# EAGLE design BlueBus (EAGLE 9.6.2)

## Sheet 1 of 5
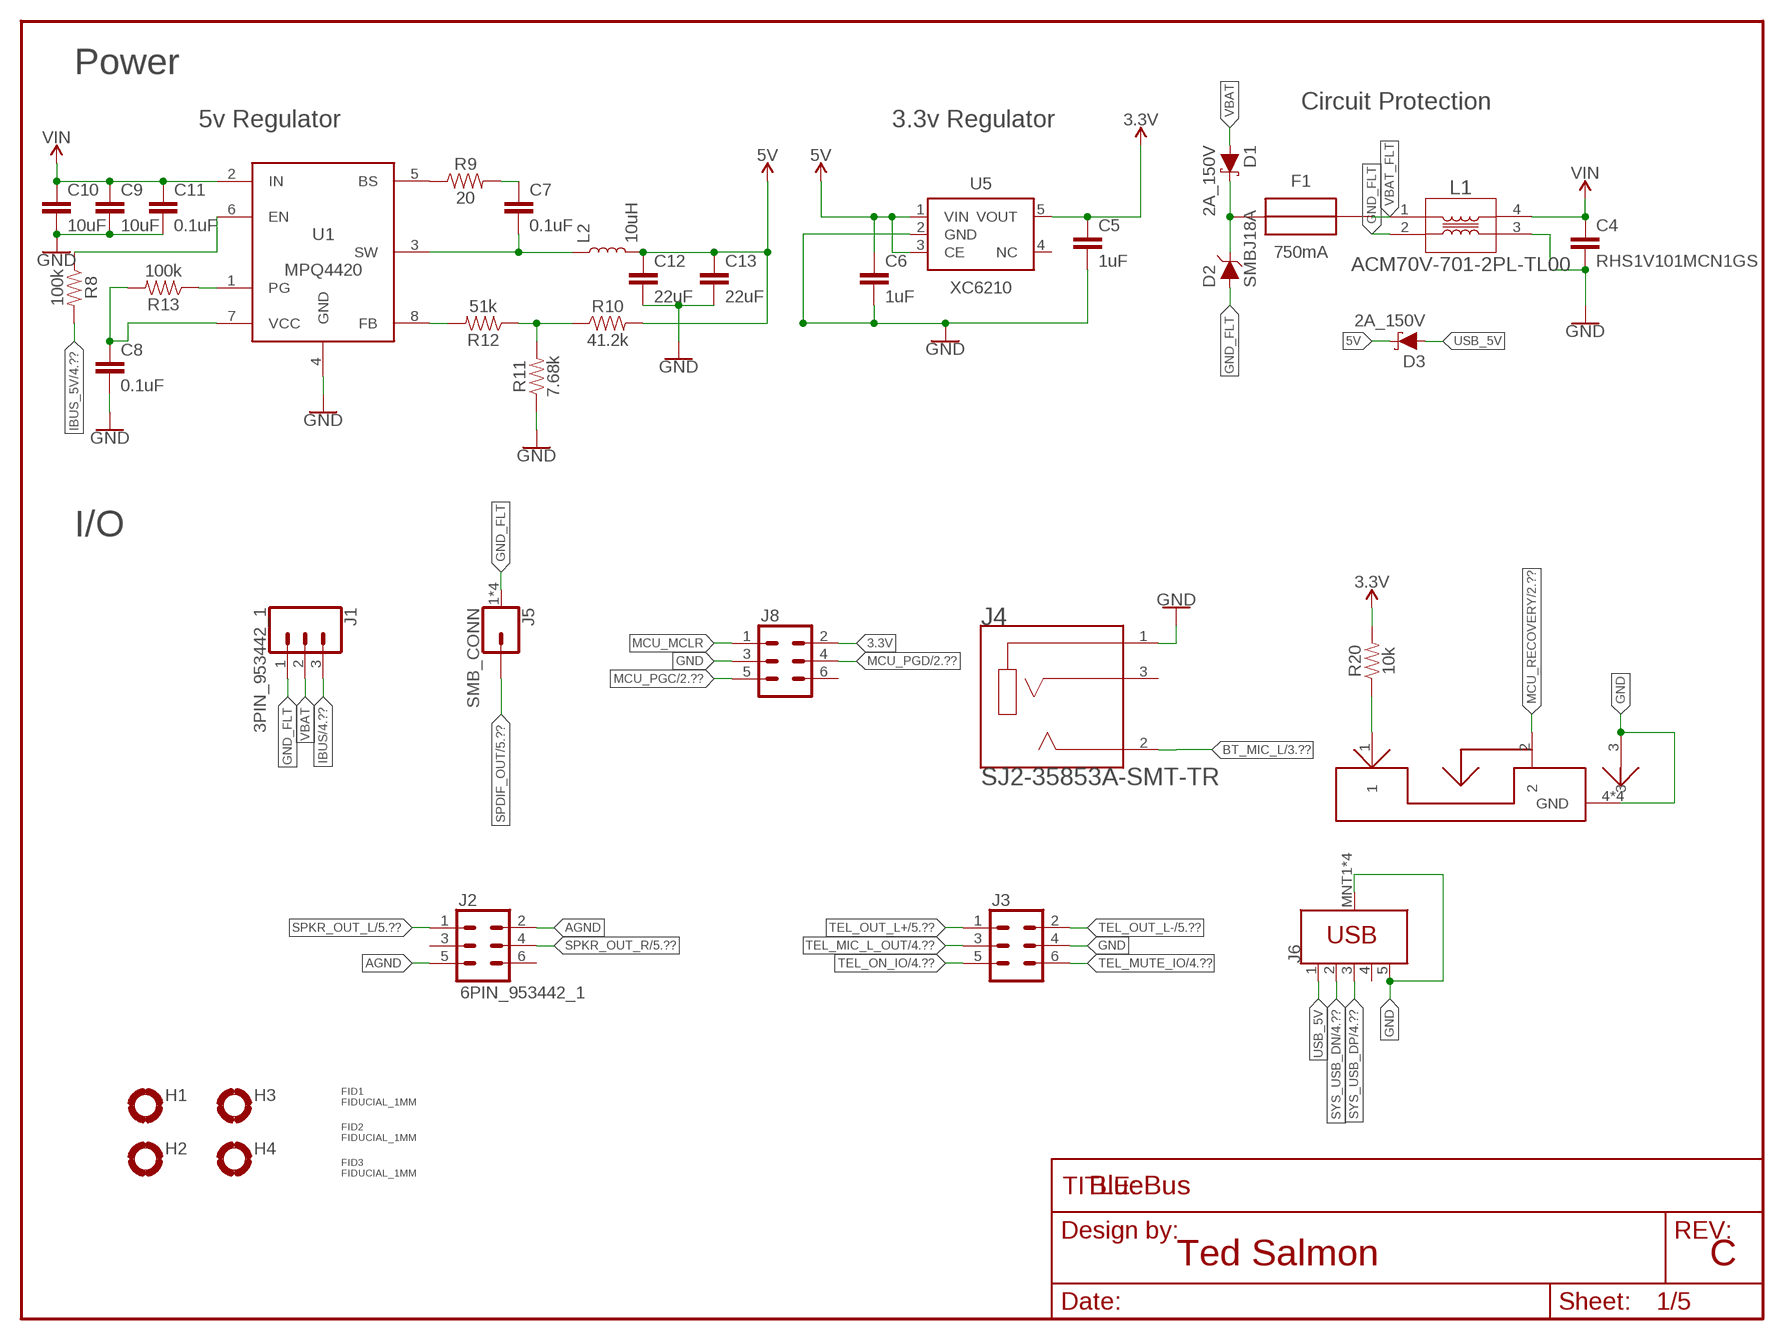
[diagram p0: schematic, sheet 1]

### Parts
C4  RHS1V101MCN1GS  [RHS1V101MCN1GS]
C5  1uF  1UF0603  [0603]
C6  1uF  1UF0603  [0603]
C7  0.1uF  0.1UF0603  [0603]
C8  0.1uF  0.1UF0603  [0603]
C9  10uF  10UF  [1206]
C10  10uF  10UF  [1206]
C11  0.1uF  0.1UF0603  [0603]
C12  22uF  22UF  [0805]
C13  22uF  22UF  [0805]
D1  2A_150V  SMD2150PL_2A_150V  [SOD123FL-2]
D2  SMBJ18A  [DO-214AA]
D3  2A_150V  SMD2150PL_2A_150V  [SOD123FL-2]
F1  750mA  LITTLEBLOCK_FUSE_.75A  [LITTLEFUSE]
FID1  FIDUCIAL_1MM  [FIDUCIAL_1MM]
FID2  FIDUCIAL_1MM  [FIDUCIAL_1MM]
FID3  FIDUCIAL_1MM  [FIDUCIAL_1MM]
FRAME1  FRAME-LETTER  [DUMMY]
H1  2,5-HOLE  [2.5-HOLE]
H2  2,5-HOLE  [2.5-HOLE]
H3  2,5-HOLE  [2.5-HOLE]
H4  2,5-HOLE  [2.5-HOLE]
J1  3PIN_953442_1  [TE_MQS_3PIN]
J2  6PIN_953442_1  [TE_MQS_6PIN]
J3  6PIN_5_103166_1  [TE_AMPMODU_6_PIN]
J4  SJ2-35853A-SMT-TR  [CUI_SJ2_35853A_SMT_TR]
J5  SMB_CONN  [MOLEX_SMB]
J6  USB3080-30-01-A  [USB3080-30-01-A]
J7  PCM12SMTR  [PCM12SMTR]
J8  TC2030NL  [TC2030-NL]
L1  ACM70V-701-2PL-TL00  [ACM70V-701-2PL-TL00]
L2  10uH  MPL-SE5040-100  [MPL-SE5040]
R8  100k  100KOHM0603  [0603]
R9  20  20OHM0603  [0603]
R10  41.2k  41.2KOHM0603  [0603]
R11  7.68k  7.68KOHM0603  [0603]
R12  51k  51KOHM0603  [0603]
R13  100k  100KOHM0603  [0603]
R20  10k  10KOHM0603  [0603]
U1  MPQ4420  [TSOT23-8]
U5  XC6210  XC6210SOT25  [SOT23-5]

### Nets
3.3V [3.3V]: C5.1 J8.2 R20.2 U5.5(VOUT) ; also sheet 2,3,4,5
5V [USB_5V]: C6.1 C12.1 C13.1 D3.C L2.2 R10.2 U5.1(VIN) U5.3(CE) ; also sheet 4,5
5VREG_BS: R9.1 U1.5(BS)
5VREG_BS_CAP: C7.1 R9.2
5VREG_EN: R8.1 U1.6(EN)
5VREG_FB: R12.2 U1.8(FB)
5VREG_FB_T: R10.1 R11.2 R12.1
5VREG_PG: R13.1 U1.1(PG)
5VREG_SW: C7.2 L2.1 U1.3(SW)
5VREG_VCC: C8.1 R13.2 U1.7(VCC)
AGND: J2.2 J2.5 ; also sheet 5
BT_MIC_L: J4.2(TIP) ; also sheet 3,4
GND: C4.2 C5.2 C6.2 C8.2 C9.2 C10.2 C11.2 C12.2 C13.2 J3.4 J4.1(SLEEVE) J6.5(GND) J6.MNT1(SHIELD) J6.MNT2(SHIELD) J6.MNT3(SHIELD) J6.MNT4(SHIELD) J7.3 J7.4(GND) J7.5(GND) J7.6(GND) J7.7(GND) J8.3 L1.3 R11.1 U1.4(GND) U5.2(GND) ; also sheet 2,3,4,5
GND_FLT: D2.A J1.1 J5.1(GND) J5.2(GND) J5.3(GND) J5.4(GND) L1.2
IBUS [Data]: J1.3 ; also sheet 4
IBUS_5V: R8.2 ; also sheet 4
MCU_MCLR [MCU_Data]: J8.1 ; also sheet 2
MCU_PGC [MCU_Data]: J8.5 ; also sheet 2
MCU_PGD [MCU_Data]: J8.4 ; also sheet 2
MCU_RECOVERY [MCU_Data]: J7.2 ; also sheet 2
RECOVERY_ON [MCU_Data]: J7.1 R20.1
SPDIF_OUT: J5.P$1 ; also sheet 5
SPKR_OUT_L: J2.1 ; also sheet 5
SPKR_OUT_R: J2.4 ; also sheet 5
SYS_USB_DN [Data]: J6.2(D-) ; also sheet 4
SYS_USB_DP [Data]: J6.3(D+) ; also sheet 4
TEL_MIC_L_OUT: J3.3 ; also sheet 4
TEL_MUTE_IO: J3.6 ; also sheet 4
TEL_ON_IO: J3.5 ; also sheet 4
TEL_OUT_L+: J3.1 ; also sheet 5
TEL_OUT_L-: J3.2 ; also sheet 5
USB_5V: D3.A J6.1(VBUS)
VBAT: D1.A J1.2
VBAT_DIODE: D1.C D2.C F1.IN(OUT)
VBAT_FLT: F1.OUT(IN) L1.1
VIN [VIN]: C4.1 C9.1 C10.1 C11.1 L1.4 U1.2(IN) ; also sheet 4
Unconnected: J2.3 J2.6 J4.3(RING) J6.4(ID) J8.6 U5.4(NC)

### Notes on the sheet
- Power
- Circuit Protection
- 5v Regulator | 3.3v Regulator
- I/O
- Ted Salmon | C

## Sheet 2 of 5
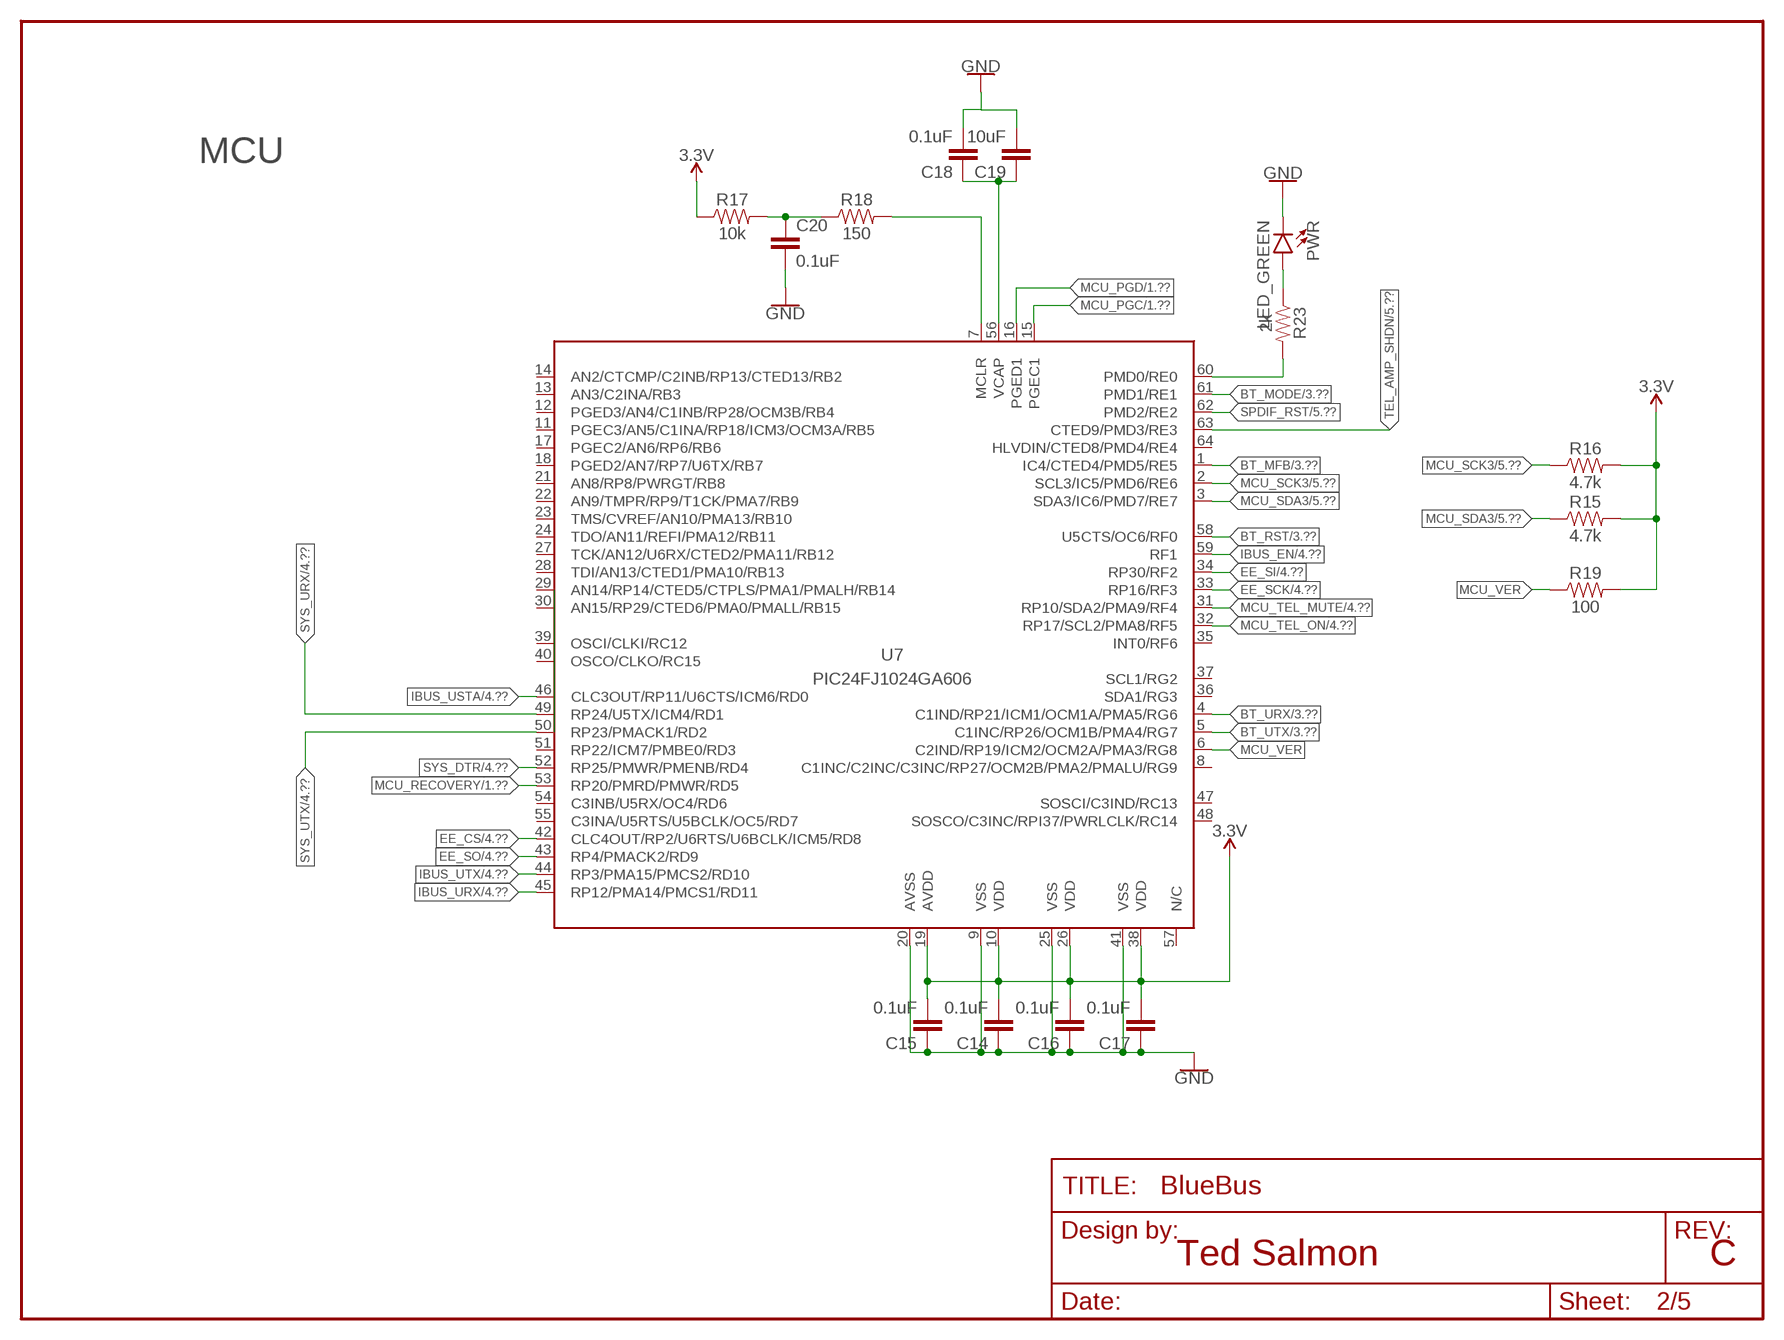
[diagram p1: schematic, sheet 2]

### Parts
C14  0.1uF  0.1UF0603  [0603]
C15  0.1uF  0.1UF0603  [0603]
C16  0.1uF  0.1UF0603  [0603]
C17  0.1uF  0.1UF0603  [0603]
C18  0.1uF  0.1UF0603  [0603]
C19  10uF  10UF0603  [0603]
C20  0.1uF  0.1UF0603  [0603]
FRAME2  FRAME-LETTER  [DUMMY]
PWR  LED_GREEN  [LED-0805]
R15  4.7k  4.7KOHM0603  [0603]
R16  4.7k  4.7KOHM0603  [0603]
R17  10k  10KOHM0603  [0603]
R18  150  150OHM0603  [0603]
R19  100  100OHM0603  [0603]
R23  2k  2KOHM0603  [0603]
U7  PIC24FJ1024GA606  [TQFP64]

### Nets
3.3V [3.3V]: C14.2 C15.2 C16.2 C17.2 R15.2 R16.2 R17.1 R19.2 U7.10(VDD) U7.19(AVDD) U7.26(VDD) U7.38(VDD) ; also sheet 1,3,4,5
BT_MFB [MCU_Data]: U7.1(IC4/CTED4/PMD5/RE5) ; also sheet 3
BT_MODE [MCU_Data]: U7.61(PMD1/RE1) ; also sheet 3
BT_RST [MCU_Data]: U7.58(U5CTS/OC6/RF0) ; also sheet 3
BT_URX [MCU_Data]: U7.4(C1IND/RP21/ICM1/OCM1A/PMA5/RG6) ; also sheet 3
BT_UTX [MCU_Data]: U7.5(C1INC/RP26/OCM1B/PMA4/RG7) ; also sheet 3
EE_CS [MCU_Data]: U7.42(CLC4OUT/RP2/U6RTS/U6BCLK/ICM5/RD8) ; also sheet 4
EE_SCK [MCU_Data]: U7.33(RP16/RF3) ; also sheet 4
EE_SI [MCU_Data]: U7.34(RP30/RF2) ; also sheet 4
EE_SO [MCU_Data]: U7.43(RP4/PMACK2/RD9) ; also sheet 4
GND: C14.1 C15.1 C16.1 C17.1 C18.2 C19.2 C20.2 PWR.-(C) U7.9(VSS) U7.20(AVSS) U7.25(VSS) U7.41(VSS) ; also sheet 1,3,4,5
IBUS_EN [MCU_Data]: U7.59(RF1) ; also sheet 4
IBUS_URX [MCU_Data]: U7.45(RP12/PMA14/PMCS1/RD11) ; also sheet 4
IBUS_USTA [MCU_Data]: U7.46(CLC3OUT/RP11/U6CTS/ICM6/RD0) ; also sheet 4
IBUS_UTX [MCU_Data]: U7.44(RP3/PMA15/PMCS2/RD10) ; also sheet 4
MCU_MCLR [MCU_Data]: R18.2 U7.7(MCLR) ; also sheet 1
MCU_MCLR_RES [MCU_Data]: C20.1 R17.2 R18.1
MCU_ON_LED [MCU_Data]: R23.2 U7.60(PMD0/RE0)
MCU_ON_LED_RES: PWR.+(A) R23.1
MCU_PGC [MCU_Data]: U7.15(PGEC1) ; also sheet 1
MCU_PGD [MCU_Data]: U7.16(PGED1) ; also sheet 1
MCU_RECOVERY [MCU_Data]: U7.53(RP20/PMRD/PMWR/RD5) ; also sheet 1
MCU_SCK3 [MCU_Data]: R16.1 U7.2(SCL3/IC5/PMD6/RE6) ; also sheet 5
MCU_SDA3 [MCU_Data]: R15.1 U7.3(SDA3/IC6/PMD7/RE7) ; also sheet 5
MCU_TEL_MUTE [MCU_Data]: U7.31(RP10/SDA2/PMA9/RF4) ; also sheet 4
MCU_TEL_ON [MCU_Data]: U7.32(RP17/SCL2/PMA8/RF5) ; also sheet 4
MCU_VCAP [MCU_Data]: C18.1 C19.1 U7.56(VCAP)
MCU_VER: R19.1 U7.6(C2IND/RP19/ICM2/OCM2A/PMA3/RG8)
SPDIF_RST: U7.62(PMD2/RE2) ; also sheet 5
SYS_DTR [MCU_Data]: U7.52(RP25/PMWR/PMENB/RD4) ; also sheet 4
SYS_URX [MCU_Data]: U7.49(RP24/U5TX/ICM4/RD1) ; also sheet 4
SYS_UTX [MCU_Data]: U7.50(RP23/PMACK1/RD2) ; also sheet 4
TEL_AMP_SHDN [MCU_Data]: U7.63(CTED9/PMD3/RE3) ; also sheet 5
Unconnected: U7.8(C1INC/C2INC/C3INC/RP27/OCM2B/PMA2/PMALU/RG9) U7.11(PGEC3/AN5/C1INA/RP18/ICM3/OCM3A/RB5) U7.12(PGED3/AN4/C1INB/RP28/OCM3B/RB4) U7.13(AN3/C2INA/RB3) U7.14(AN2/CTCMP/C2INB/RP13/CTED13/RB2) U7.17(PGEC2/AN6/RP6/RB6) U7.18(PGED2/AN7/RP7/U6TX/RB7) U7.21(AN8/RP8/PWRGT/RB8) U7.22(AN9/TMPR/RP9/T1CK/PMA7/RB9) U7.23(TMS/CVREF/AN10/PMA13/RB10) U7.24(TDO/AN11/REFI/PMA12/RB11) U7.27(TCK/AN12/U6RX/CTED2/PMA11/RB12) U7.28(TDI/AN13/CTED1/PMA10/RB13) U7.29(AN14/RP14/CTED5/CTPLS/PMA1/PMALH/RB14) U7.30(AN15/RP29/CTED6/PMA0/PMALL/RB15) U7.35(INT0/RF6) U7.36(SDA1/RG3) U7.37(SCL1/RG2) U7.39(OSCI/CLKI/RC12) U7.40(OSCO/CLKO/RC15) U7.47(SOSCI/C3IND/RC13) U7.48(SOSCO/C3INC/RPI37/PWRLCLK/RC14) U7.51(RP22/ICM7/PMBE0/RD3) U7.54(C3INB/U5RX/OC4/RD6) U7.55(C3INA/U5RTS/U5BCLK/OC5/RD7) U7.57(N/C) U7.64(HLVDIN/CTED8/PMD4/RE4)

### Notes on the sheet
- MCU
- Ted Salmon | C

## Sheet 3 of 5
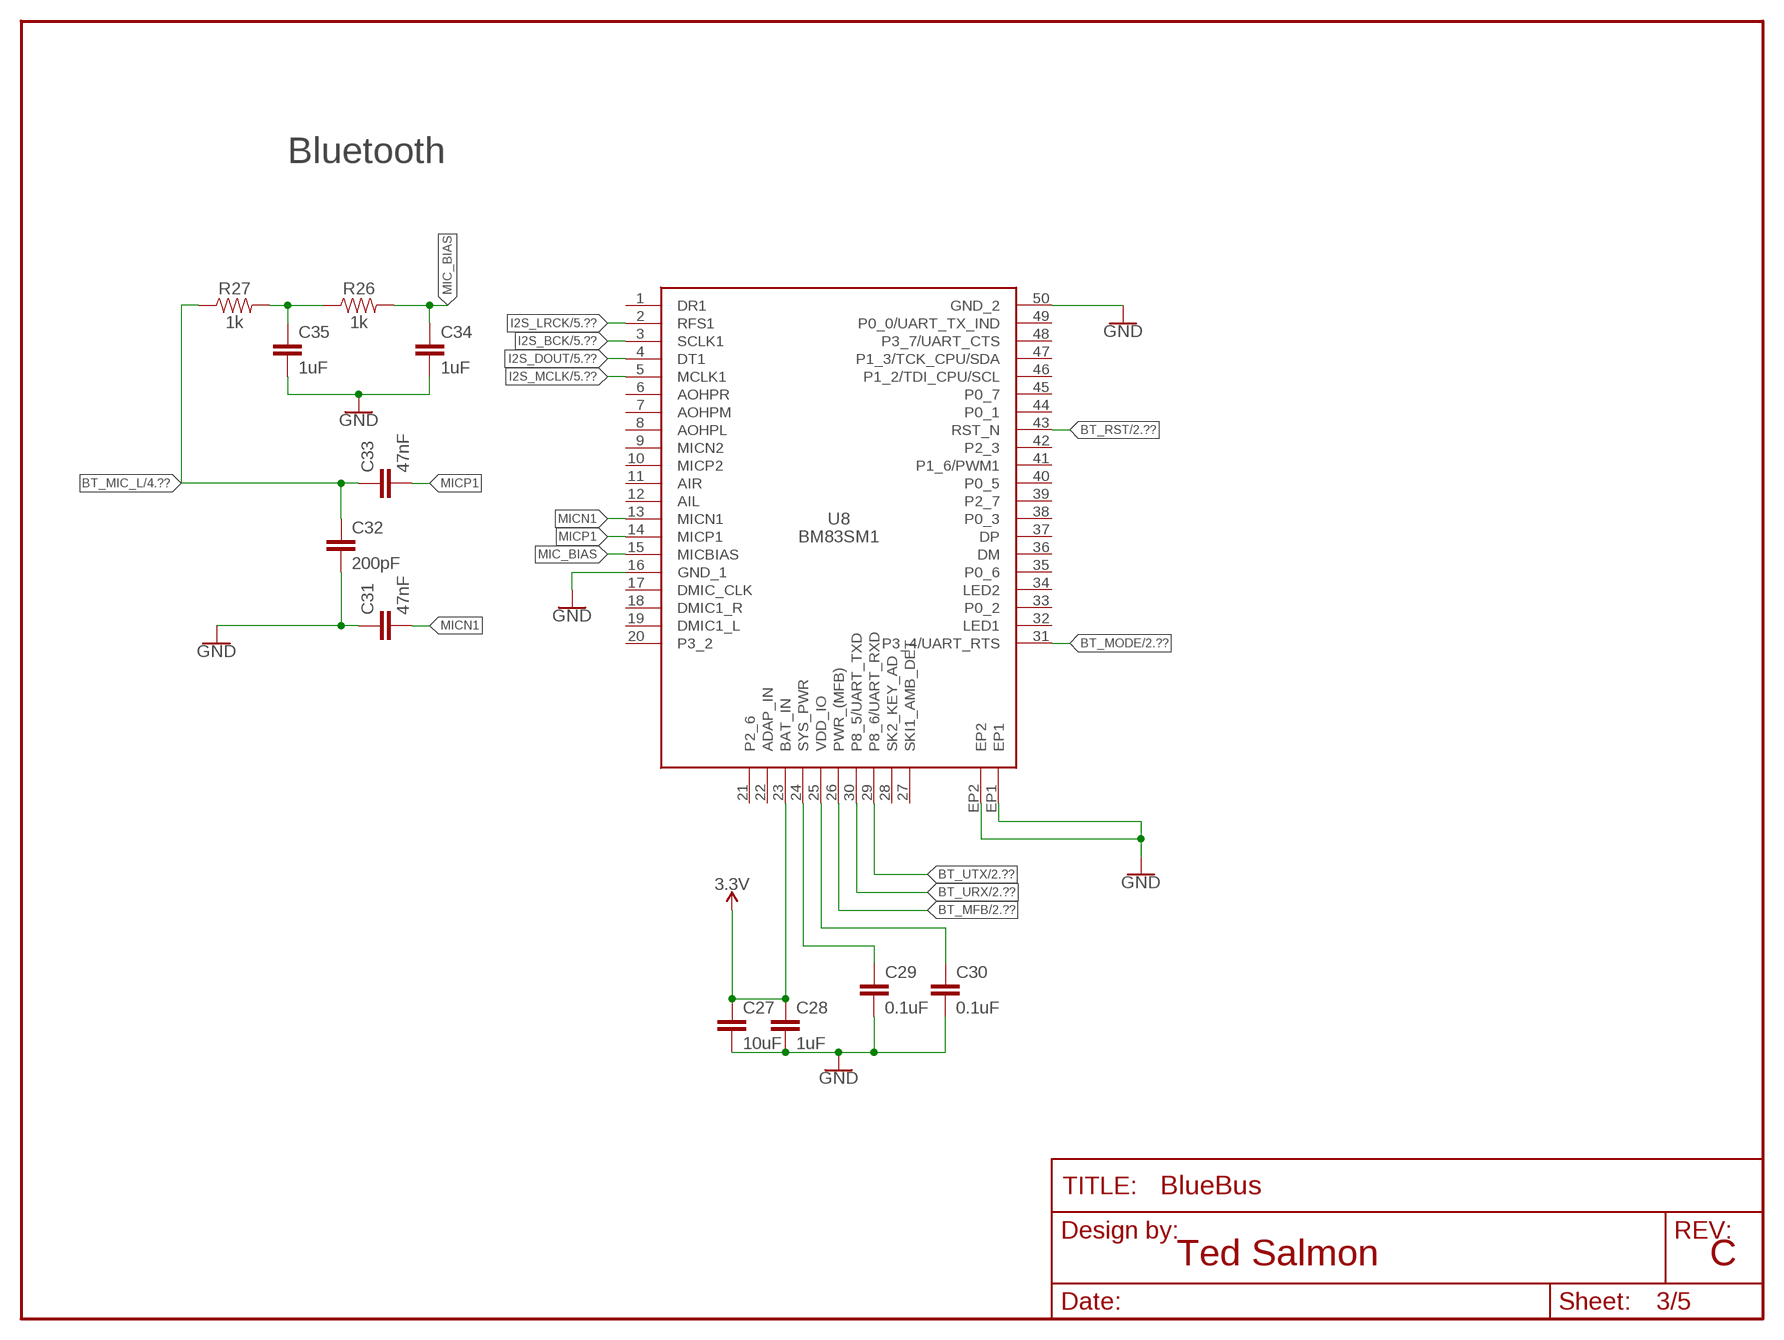
[diagram p2: schematic, sheet 3]

### Parts
C27  10uF  10UF0603  [0603]
C28  1uF  1UF0603  [0603]
C29  0.1uF  0.1UF0603  [0603]
C30  0.1uF  0.1UF0603  [0603]
C31  47nF  47NF0603  [0603]
C32  200pF  220PF0603  [0603]
C33  47nF  47NF0603  [0603]
C34  1uF  1UF0603  [0603]
C35  1uF  1UF0603  [0603]
FRAME4  FRAME-LETTER  [DUMMY]
R26  1k  1KOHM0603  [0603]
R27  1k  1KOHM0603  [0603]
U8  BM83SM1  [BM83SM1]

### Nets
3.3V [3.3V]: C27.1 C28.1 U8.23(BAT_IN) ; also sheet 1,2,4,5
BT_MFB [MCU_Data]: U8.26(PWR_(MFB)) ; also sheet 2
BT_MIC_L: C32.1 C33.1 R27.1 ; also sheet 1,4
BT_MODE [MCU_Data]: U8.31(P3_4/UART_RTS) ; also sheet 2
BT_RST [MCU_Data]: U8.43(RST_N) ; also sheet 2
BT_SYS_PWR: C29.1 U8.24(SYS_PWR)
BT_URX [MCU_Data]: U8.30(P8_5/UART_TXD) ; also sheet 2
BT_UTX [MCU_Data]: U8.29(P8_6/UART_RXD) ; also sheet 2
BT_VDD_IO: C30.1 U8.25(VDD_IO)
GND: C27.2 C28.2 C29.2 C30.2 C31.1 C32.2 C34.2 C35.2 U8.16(GND_1) U8.50(GND_2) U8.EP1 U8.EP2 ; also sheet 1,2,4,5
I2S_BCK: U8.3(SCLK1) ; also sheet 5
I2S_DOUT: U8.4(DT1) ; also sheet 5
I2S_LRCK: U8.2(RFS1) ; also sheet 5
I2S_MCLK: U8.5(MCLK1) ; also sheet 5
MIC_BIAS: C34.1 R26.2 U8.15(MICBIAS)
MICN1: C31.2 U8.13(MICN1)
MICP1: C33.2 U8.14(MICP1)
MICP1_RES: C35.1 R26.1 R27.2
Unconnected: U8.1(DR1) U8.6(AOHPR) U8.7(AOHPM) U8.8(AOHPL) U8.9(MICN2) U8.10(MICP2) U8.11(AIR) U8.12(AIL) U8.17(DMIC_CLK) U8.18(DMIC1_R) U8.19(DMIC1_L) U8.20(P3_2) U8.21(P2_6) U8.22(ADAP_IN) U8.27(SKI1_AMB_DET) U8.28(SK2_KEY_AD) U8.32(LED1) U8.33(P0_2) U8.34(LED2) U8.35(P0_6) U8.36(DM) U8.37(DP) U8.38(P0_3) U8.39(P2_7) U8.40(P0_5) U8.41(P1_6/PWM1) U8.42(P2_3) U8.44(P0_1) U8.45(P0_7) U8.46(P1_2/TDI_CPU/SCL) U8.47(P1_3/TCK_CPU/SDA) U8.48(P3_7/UART_CTS) U8.49(P0_0/UART_TX_IND)

### Notes on the sheet
- Bluetooth
- Ted Salmon | C

## Sheet 4 of 5
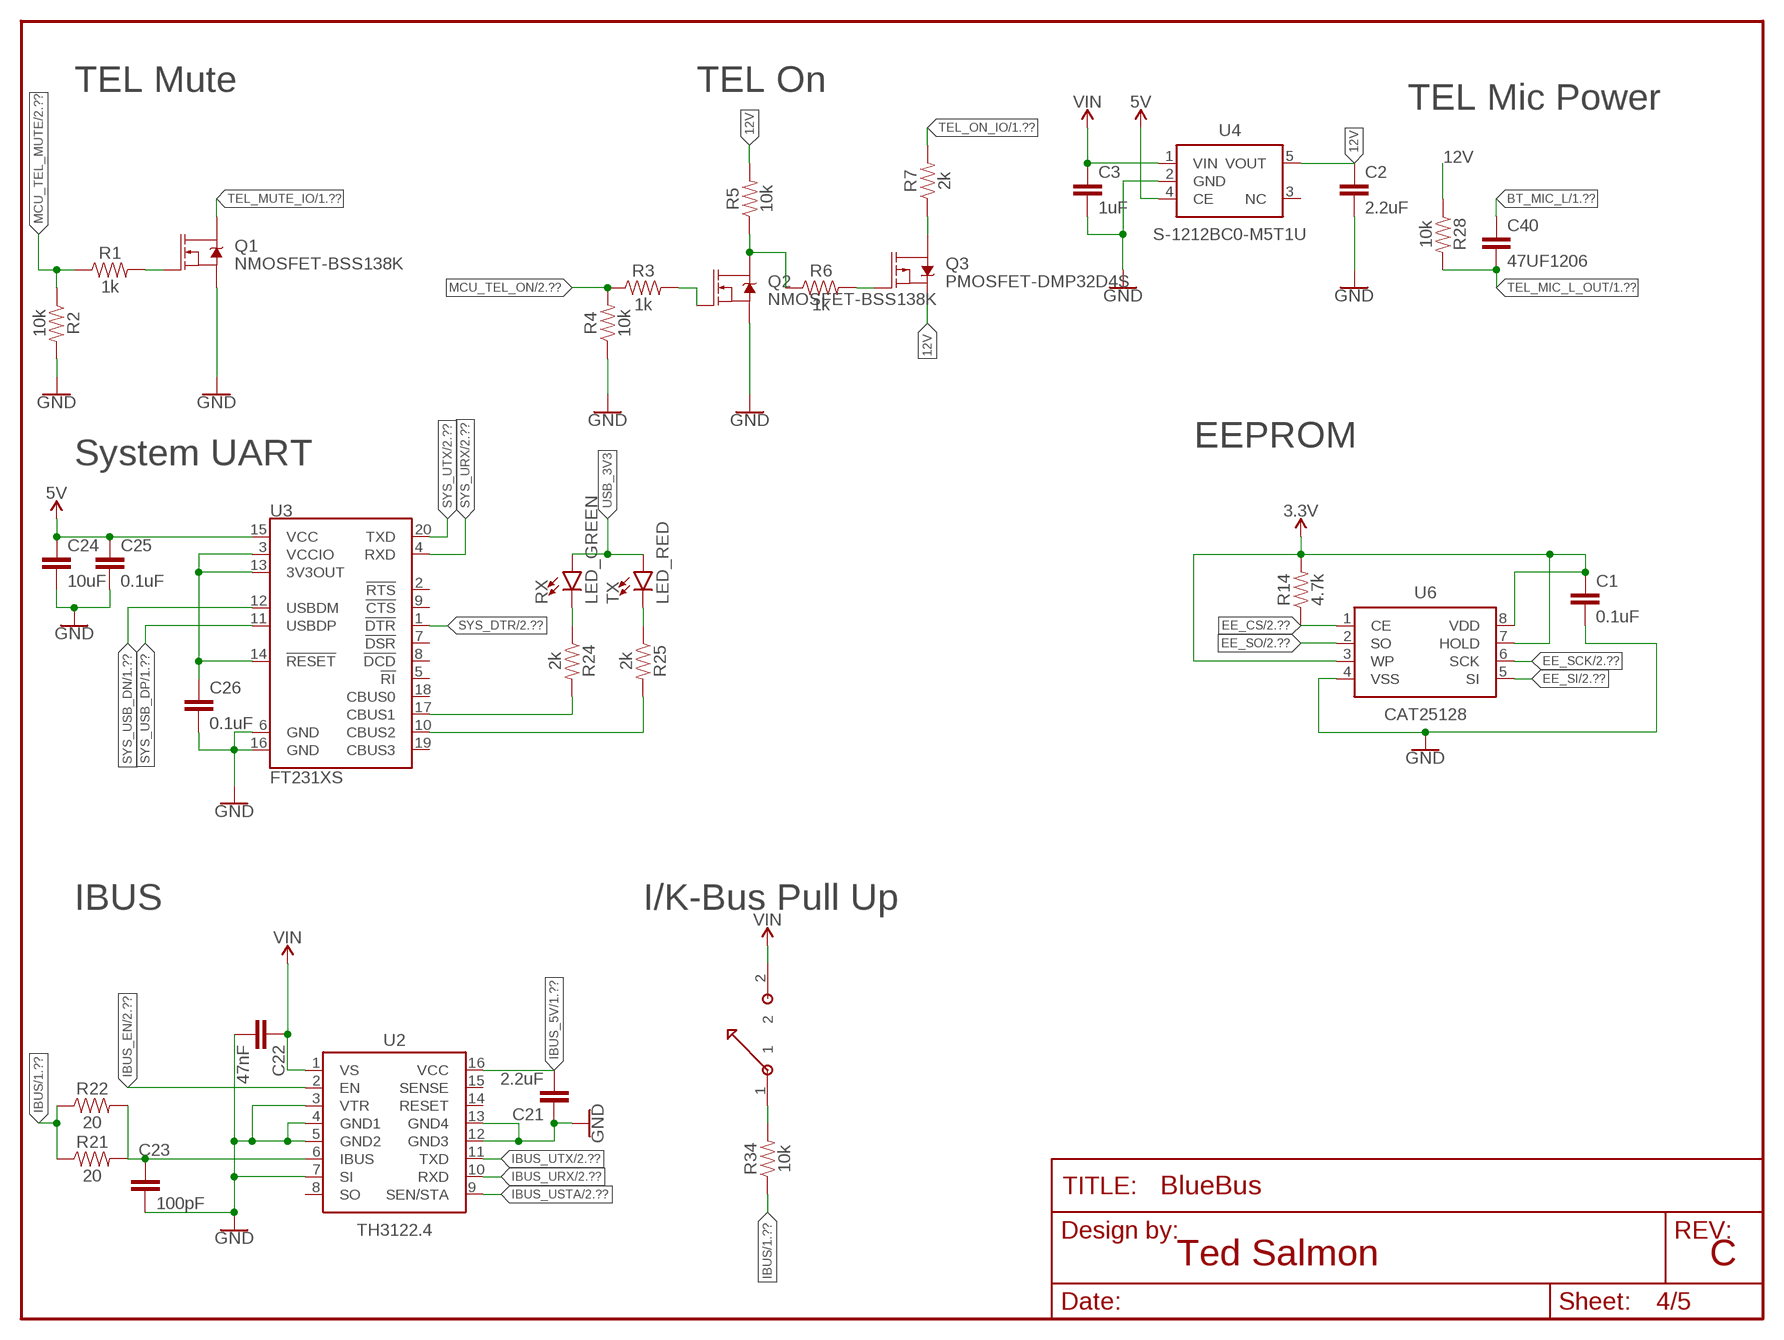
[diagram p3: schematic, sheet 4]

### Parts
C1  0.1uF  0.1UF0603  [0603]
C2  2.2uF  2.2UF0603  [0603]
C3  1uF  1UF0603  [0603]
C21  2.2uF  2.2UF0603  [0603]
C22  47nF  47NF0603  [0603]
C23  100pF  100PF0603  [0603]
C24  10uF  10UF0603  [0603]
C25  0.1uF  0.1UF0603  [0603]
C26  0.1uF  0.1UF0603  [0603]
C40  47UF1206  [1206]
FRAME3  FRAME-LETTER  [DUMMY]
Q1  NMOSFET-BSS138K  [SOT-23]
Q2  NMOSFET-BSS138K  [SOT-23]
Q3  PMOSFET-DMP32D4S  [SOT-23]
R1  1k  1KOHM0603  [0603]
R2  10k  10KOHM0603  [0603]
R3  1k  1KOHM0603  [0603]
R4  10k  10KOHM0603  [0603]
R5  10k  10KOHM0603  [0603]
R6  1k  1KOHM0603  [0603]
R7  2k  2KOHM0603  [0603]
R14  4.7k  4.7KOHM0603  [0603]
R21  20  20OHM0603  [0603]
R22  20  20OHM0603  [0603]
R24  2k  2KOHM0603  [0603]
R25  2k  2KOHM0603  [0603]
R28  10k  10KOHM0603  [0603]
R34  10k  10KOHM0603  [0603]
RX  LED_GREEN  [LED-0805]
SW1  CHS-01TA1  [CHS-01TA1]
TX  LED_RED  [LED-0805]
U2  TH3122.4  [SOIC16DF]
U3  FT231XS  [SSOP20_L]
U4  S-1212BC0-M5T1U  S-1212BC0M5T1  [SOT23-5]
U6  CAT25128  [TSSOP-8]

### Nets
3.3V [3.3V]: C1.1 R14.2 U6.3(WP) U6.7(HOLD) U6.8(VDD) ; also sheet 1,2,3,5
5V [USB_5V]: C24.1 C25.1 U3.15(VCC) U4.4(CE) ; also sheet 1,5
12V [VIN]: C2.1 Q3.2(S) R5.2 R28.1 U4.5(VOUT)
BT_MIC_L: C40.1 ; also sheet 1,3
EE_CS [MCU_Data]: R14.1 U6.1(CE) ; also sheet 2
EE_SCK [MCU_Data]: U6.6(SCK) ; also sheet 2
EE_SI [MCU_Data]: U6.5(SI) ; also sheet 2
EE_SO [MCU_Data]: U6.2(SO) ; also sheet 2
GND: C1.2 C2.2 C3.2 C21.1 C22.2 C23.2 C24.2 C25.2 C26.2 Q1.2(S) Q2.2(S) R2.2 R4.1 U2.3(VTR) U2.4(GND1) U2.5(GND2) U2.7(SI) U2.12(GND3) U2.13(GND4) U3.6(GND) U3.16(GND) U4.2(GND) U6.4(VSS) ; also sheet 1,2,3,5
IBUS [Data]: R21.1 R22.1 R34.1 ; also sheet 1
IBUS_5V: C21.2 U2.16(VCC) ; also sheet 1
IBUS_EN [MCU_Data]: U2.2(EN) ; also sheet 2
IBUS_FILT: C23.1 R21.2 R22.2 U2.6(IBUS)
IBUS_PU: R34.2 SW1.1
IBUS_URX [MCU_Data]: U2.10(RXD) ; also sheet 2
IBUS_USTA [MCU_Data]: U2.9(SEN/STA) ; also sheet 2
IBUS_UTX [MCU_Data]: U2.11(TXD) ; also sheet 2
MCU_TEL_MUTE [MCU_Data]: R1.1 R2.1 ; also sheet 2
MCU_TEL_MUTE_RES: Q1.1(G) R1.2
MCU_TEL_ON [MCU_Data]: R3.1 R4.2 ; also sheet 2
MCU_TEL_ON_NRES: Q2.1(G) R3.2
SYS_DTR [MCU_Data]: U3.1(!DTR) ; also sheet 2
SYS_RX_LED: R24.2 U3.17(CBUS1)
SYS_RX_LED_RES: R24.1 RX.-(C)
SYS_TX_LED: R25.2 U3.10(CBUS2)
SYS_TX_LED_RES: R25.1 TX.-(C)
SYS_URX [MCU_Data]: U3.4(RXD) ; also sheet 2
SYS_USB_DN [Data]: U3.12(USBDM) ; also sheet 1
SYS_USB_DP [Data]: U3.11(USBDP) ; also sheet 1
SYS_UTX [MCU_Data]: U3.20(TXD) ; also sheet 2
TEL_MIC_L_OUT: C40.2 R28.2 ; also sheet 1
TEL_MUTE_IO: Q1.3(D) ; also sheet 1
TEL_ON: Q3.3(D) R7.1
TEL_ON_IO: R7.2 ; also sheet 1
TEL_ON_P: Q2.3(D) R5.1 R6.1
TEL_ON_P_RES: Q3.1(G) R6.2
USB_3V3: C26.1 RX.+(A) TX.+(A) U3.3(VCCIO) U3.13(3V3OUT) U3.14(!RESET)
VIN [VIN]: C3.1 C22.1 SW1.2 U2.1(VS) U4.1(VIN) ; also sheet 1
Unconnected: U2.8(SO) U2.14(RESET) U2.15(SENSE) U3.2(!RTS) U3.5(!RI) U3.7(!DSR) U3.8(!DCD) U3.9(!CTS) U3.18(CBUS0) U3.19(CBUS3) U4.3(NC)

### Notes on the sheet
- TEL Mute | TEL On
- TEL Mic Power
- EEPROM
- System UART
- IBUS | I/K-Bus Pull Up
- Ted Salmon | C

## Sheet 5 of 5
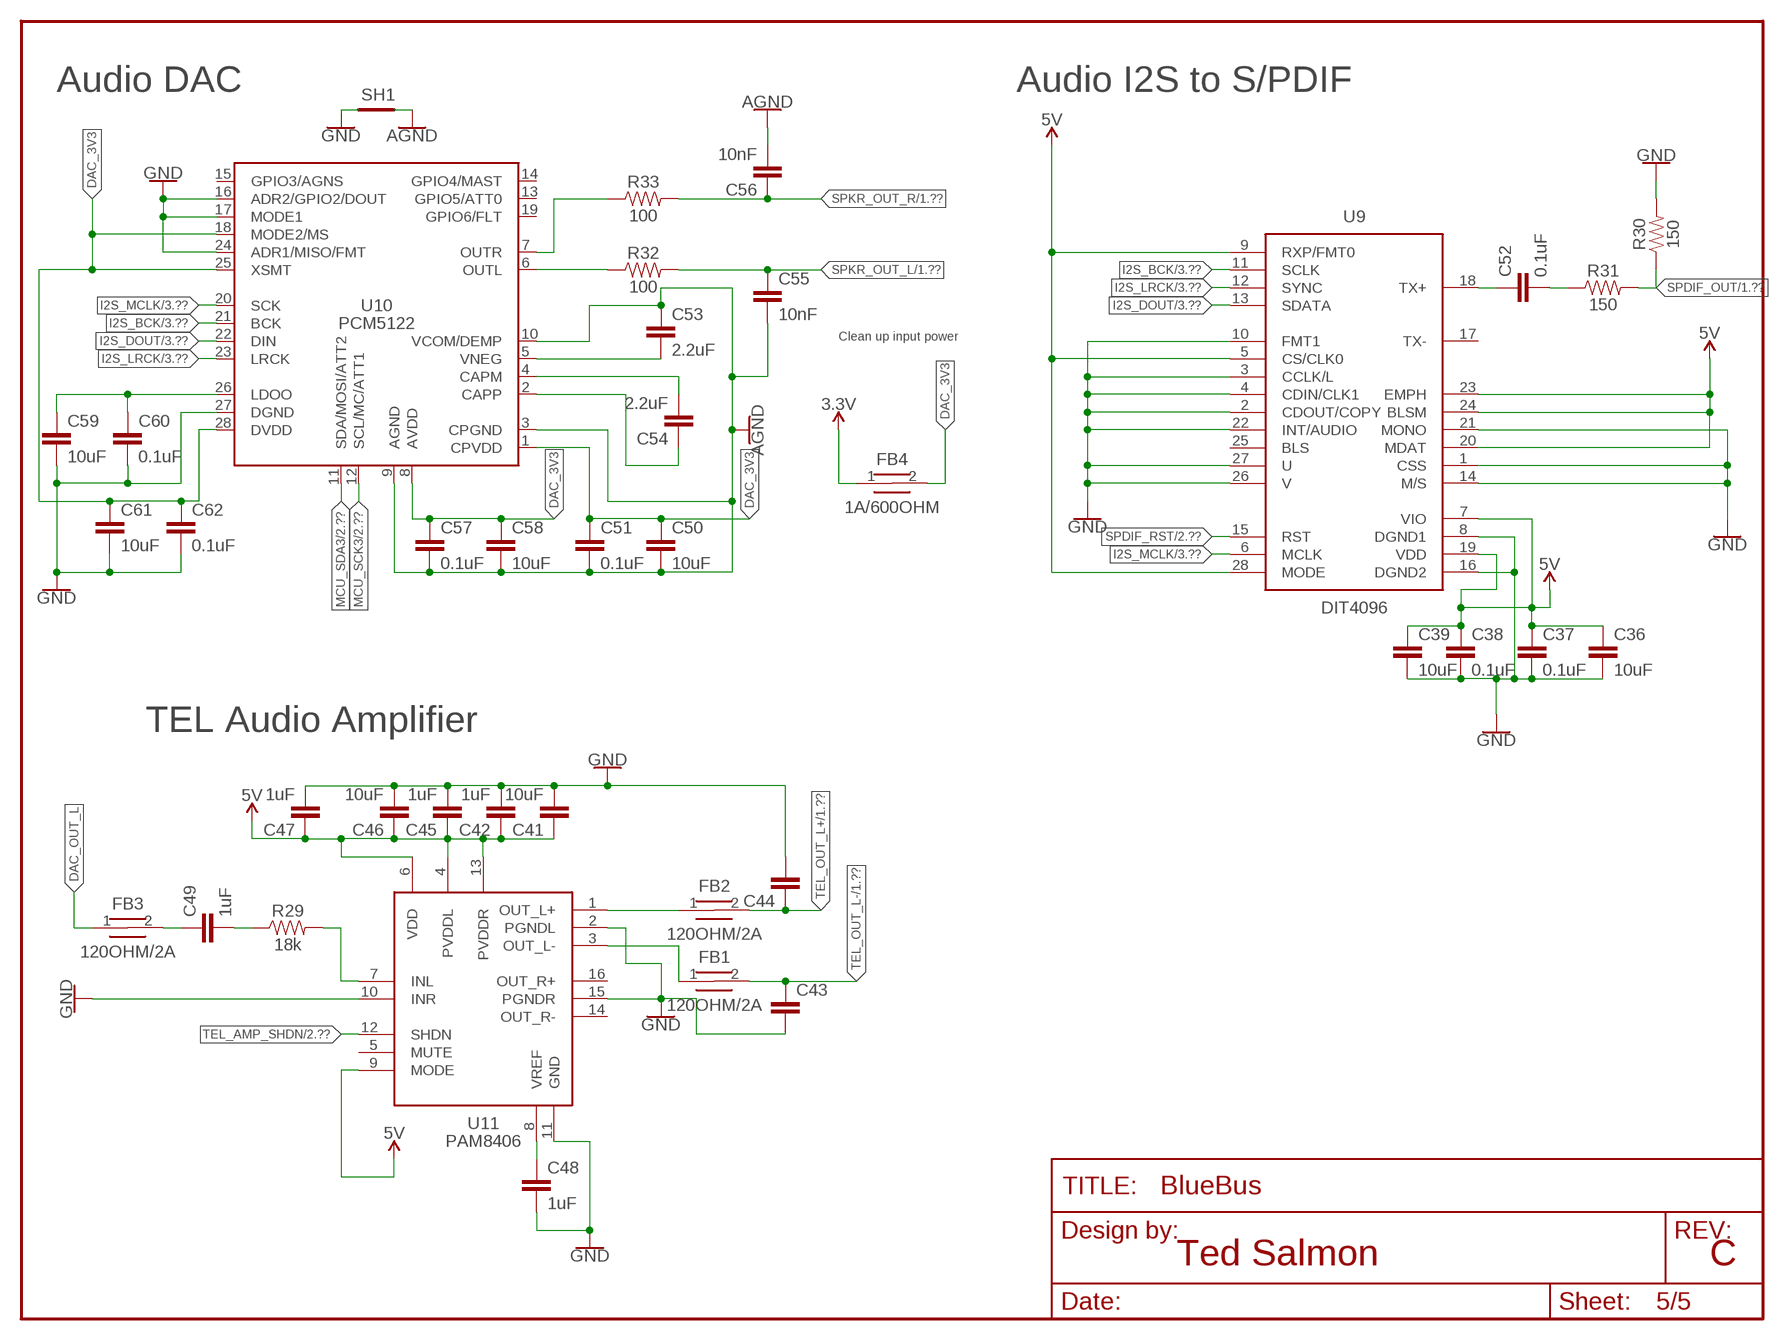
[diagram p4: schematic, sheet 5]

### Parts
C36  10uF  10UF0603  [0603]
C37  0.1uF  0.1UF0603  [0603]
C38  0.1uF  0.1UF0603  [0603]
C39  10uF  10UF0603  [0603]
C41  10uF  10UF0603  [0603]
C42  1uF  1UF0603  [0603]
C43  200pF  220PF0603  [0603]
C44  200pF  220PF0603  [0603]
C45  1uF  1UF0603  [0603]
C46  10uF  10UF0603  [0603]
C47  1uF  1UF0603  [0603]
C48  1uF  1UF0603  [0603]
C49  1uF  1UF0603  [0603]
C50  10uF  10UF0603  [0603]
C51  0.1uF  0.1UF0603  [0603]
C52  0.1uF  0.1UF0603  [0603]
C53  2.2uF  2.2UF0603  [0603]
C54  2.2uF  2.2UF0603  [0603]
C55  10nF  10NF0603  [0603]
C56  10nF  10NF0603  [0603]
C57  0.1uF  0.1UF0603  [0603]
C58  10uF  10UF0603  [0603]
C59  10uF  10UF0603  [0603]
C60  0.1uF  0.1UF0603  [0603]
C61  10uF  10UF0603  [0603]
C62  0.1uF  0.1UF0603  [0603]
FB1  120OHM/2A  FERRITE_2A/120OHM0603  [0603]
FB2  120OHM/2A  FERRITE_2A/120OHM0603  [0603]
FB3  120OHM/2A  FERRITE_2A/120OHM0603  [0603]
FB4  1A/600OHM  FERRITE_1A/600OHM  [0603]
FRAME5  FRAME-LETTER  [DUMMY]
R29  18k  18KOHM0603  [0603]
R30  150  150OHM0603  [0603]
R31  150  150OHM0603  [0603]
R32  100  100OHM0603  [0603]
R33  100  100OHM0603  [0603]
SH1  SHORTT5  [SHORT_TOP-50]
U9  DIT4096  [TSSOP28]
U10  PCM5122  [TSSOP28]
U11  PAM8406  [SOP-16]

### Nets
3.3V [3.3V]: FB4.1 ; also sheet 1,2,3,4
5V [USB_5V]: C36.1 C37.1 C38.1 C39.1 C41.1 C42.1 C45.1 C46.1 C47.1 U9.5(CS/CLK0) U9.7(VIO) U9.9(RXP/FMT0) U9.19(VDD) U9.20(MDAT) U9.23(EMPH) U9.24(BLSM) U9.28(MODE) U11.4(PVDDL) U11.6(VDD) U11.9(MODE) U11.13(PVDDR) ; also sheet 1,4
AGND: C50.2 C51.2 C53.1 C55.2 C56.2 C57.2 C58.2 SH1.2 U10.3(CPGND) U10.9(AGND) U10.10(VCOM/DEMP) ; also sheet 1
DAC_3V3 [3.3V]: C50.1 C51.1 C57.1 C58.1 C61.1 C62.1 FB4.2 U10.1(CPVDD) U10.8(AVDD) U10.18(MODE2/MS) U10.25(XSMT) U10.28(DVDD)
DAC_CAPM: C54.2 U10.4(CAPM)
DAC_CAPP: C54.1 U10.2(CAPP)
DAC_LDOO: C59.1 C60.1 U10.26(LDOO)
DAC_OUT_L: FB3.1 R32.1 U10.6(OUTL)
DAC_OUT_R: R33.1 U10.7(OUTR)
DAC_VNEG: C53.2 U10.5(VNEG)
GND: C36.2 C37.2 C38.2 C39.2 C41.2 C42.2 C43.2 C44.2 C45.2 C46.2 C47.2 C48.2 C59.2 C60.2 C61.2 C62.2 R30.2 SH1.1 U9.1(CSS) U9.2(CDOUT/COPY) U9.3(CCLK/L) U9.4(CDIN/CLK1) U9.8(DGND1) U9.10(FMT1) U9.14(M/S) U9.16(DGND2) U9.21(MONO) U9.22(INT/AUDIO) U9.26(V) U9.27(U) U10.16(ADR2/GPIO2/DOUT) U10.17(MODE1) U10.24(ADR1/MISO/FMT) U10.27(DGND) U11.2(PGNDL) U11.10(INR) U11.11(GND) U11.15(PGNDR) ; also sheet 1,2,3,4
I2S_BCK: U9.11(SCLK) U10.21(BCK) ; also sheet 3
I2S_DOUT: U9.13(SDATA) U10.22(DIN) ; also sheet 3
I2S_LRCK: U9.12(SYNC) U10.23(LRCK) ; also sheet 3
I2S_MCLK: U9.6(MCLK) U10.20(SCK) ; also sheet 3
MCU_SCK3 [MCU_Data]: U10.12(SCL/MC/ATT1) ; also sheet 2
MCU_SDA3 [MCU_Data]: U10.11(SDA/MOSI/ATT2) ; also sheet 2
SPDIF_OUT: R30.1 R31.2 ; also sheet 1
SPDIF_RST: U9.15(RST) ; also sheet 2
SPDIF_TX_FLT: C52.1 U9.18(TX+)
SPDIF_TX_RES: C52.2 R31.1
SPKR_OUT_L: C55.1 R32.2 ; also sheet 1
SPKR_OUT_R: C56.1 R33.2 ; also sheet 1
TEL_AMP_IN: C49.1 FB3.2
TEL_AMP_INL: R29.2 U11.7(INL)
TEL_AMP_INL_CAP_RES: C49.2 R29.1
TEL_AMP_OUT_L+: FB2.1 U11.1(OUT_L+)
TEL_AMP_OUT_L-: FB1.1 U11.3(OUT_L-)
TEL_AMP_SHDN [MCU_Data]: U11.12(SHDN) ; also sheet 2
TEL_AMP_VREF: C48.1 U11.8(VREF)
TEL_OUT_L+: C44.1 FB2.2 ; also sheet 1
TEL_OUT_L-: C43.1 FB1.2 ; also sheet 1
Unconnected: U9.17(TX-) U9.25(BLS) U10.13(GPIO5/ATT0) U10.14(GPIO4/MAST) U10.15(GPIO3/AGNS) U10.19(GPIO6/FLT) U11.5(MUTE) U11.14(OUT_R-) U11.16(OUT_R+)

### Notes on the sheet
- Audio DAC | Audio I2S to S/PDIF
- Clean up input power
- TEL Audio Amplifier
- Ted Salmon | C

## Library data of the parts
C1 C7 C8 C11 C14-C18 C20 C25 C26 C29 C30 C37 C38 C51 C52 C57 C60 C62 = Passives:0.1UF: 0.1uF capacitor; DEVICE: 0.1UF-0603-5%-50V; MFG: KEMET; PN: C0603C104J5RACTU
C2 C21 C53 C54 = Passives:2.2UF: 2.2uF Capacitor; DEVICE: 2.2uF-0603-16V-10%; MFG: KEMET; PACKAGE: 0603; PN: C0603C225K4PAC
C3 C5 C6 C28 C34 C35 C42 C45 C47-C49 = Passives:1UF; DEVICE: 1uF-0603-16v-10%; MFG: TDK; PACKAGE: 0805; PN: CGA3E1X5R1C105K080AC
C4 = Passives:RHS1V101MCN1GS; MFG: Nichicon; PN: RHS1V101MCN1GS
C9 C10 = Passives:10UF: 10uF Capacitor 1206 Package; DEVICE: 10UF-1206-35V-10%; MFG: TDK; PACKAGE: 1206; PN: CGA5L1X7R1V106K160AC
C12 C13 = Passives:22UF; DEVICE: 22uF-0805-6.3v-10%; MFG: TDK; PACKAGE: 0805; PN: C2012X5R0J226K125AB
C19 C24 C27 C36 C39 C41 C46 C50 C58 C59 C61 = Passives:10UF: 10uF Capacitor 1206 Package; DEVICE: 10UF-0603-16V-10%; MFG: Murata; PACKAGE: 0603; PN: GRT188R61C106KE13D
C22 C31 C33 = Passives:47NF; DEVICE: 47NF-0603-25V-5%; MFG: Kemet; PN: C0603C473J3RACTU
C23 = Passives:100PF: 100pF Capacitor; DEVICE: 100PF-0603-100V-5%; MFG: KEMET; PN: C0603C101J1HACAUTO
C32 C43 C44 = Passives:220PF; DEVICE: 220pF-0603-50V-5%; MFG: Kemet; PN: C0603C221K5RACTU
C40 = Passives:47UF: 47uF Capacitor; MFG: MURATA; PN: GRM31CR61C476ME44K
C55 C56 = Passives:10NF; DEVICE: 10NF-0603-5%-50V; MFG: KEMET; PN: C0603C103J5RACTU
D1 D3 = Passives:SMD2150PL_2A_150V; MFG: MCC; PN: SMD2150PL-TP
D2 = Passives:SMBJ18A; MFG: Diodes; PN: SMBJ18A-13-F
F1 = Passives:LITTLEBLOCK_FUSE_.75A: Littlefuse 154 Series Omni-BLOK Fuse; MFG: Littelfuse; PN: 0154.750DRT
FB1-FB3 = Passives:FERRITE_2A/120OHM; MFG: Bourns; PN: MH1608-121Y
FB4 = Passives:FERRITE_1A/600OHM; MFG: Murata; PN: BLM18SP601SN1D
FID1-FID3 = MF_Aesthetics:FIDUCIAL: Library: MF_Aesthetics Description: Fiducial marking for PCB alignment inside PNP and other machines.
FRAME1-FRAME5 = Frame:FRAME-LETTER: Schematic Frame - Letter Standard 8.5x11 US Letter frame
H1-H4 = Connectors:2,5-HOLE
J1 = Connectors:3PIN_953442_1
J2 = Connectors:6PIN_953442_1: TE Conenctivity 953442-1 6-pin Header with Pinholes; MFG: TE; PN: 953442-1
J3 = Connectors:6PIN_5_103166_1; MFG: TE; PN: 5-103166-1
J4 = Connectors:SJ2-35853A-SMT-TR: 3 conductors, 3.5mm, SMT Audio Jack; MFG: CUI; PN: SJ2-35853A-SMT-TR
J5 = Connectors:SMB_CONN; MFG: Molex; PN: 73100-0259
J6 = Connectors:USB3080-30-01-A; MFG: Global Connector Technology; PN: USB3080-30-01-A
J7 = Connectors:PCM12SMTR
J8 = Connectors:TC2030
L1 = Passives:ACM70V-701-2PL-TL00; MFG: TDK; PN: ACM70V-701-2PL-TL00
L2 = Passives:MPL-SE5040-100; MFG: Monolithic Power Systems; PN: MPL-SE5040-100
PWR RX = Passives:LED_GREEN: 0805 Green LED; MFG: Wurth Elektronik; PN: 150080VS75000
Q1 Q2 = Passives:NMOSFET-BSS138K; MFG: Diodes; PN: BSS138W-7-F
Q3 = Passives:PMOSFET-DMP32D4S; MFG: Diodes; PN: DMP32D4S-7
R1 R3 R6 R26 R27 = Passives:1KOHM: 1K Ohm Resistor; DEVICE: 1KOHM-0603-1/4-0.5%; MFG: Panasonic; PN: ERJ-PA3F1001V
R2 R4 R5 R17 R20 R28 R34 = Passives:10KOHM: 10K Ohm Resistor; DEVICE: 10KOHM-0603-1/4-1%; MFG: Panasonic; PACKAGE: 0603; PN: ERJ-PA3F1002V
R7 R23-R25 = Passives:2KOHM: 2K Ohm Resistor; DEVICE: 2KOHM-0603-1/4-5%; MFG: Panasonic; PACKAGE: 0603; PN: ERJ-PA3J202V
R8 R13 = Passives:100KOHM: 100k Ohm Resistor; DEVICE: 100KOHM-0603-1/10-1%; MFG: Panasonic; PACKAGE: 0603; PN: ERJ-U03F1003V
R9 R21 R22 = Passives:20OHM; DEVICE: 20OHM-0603-1/4-1%; MFG: Panasonic; PACKAGE: 0603; PN: ERJ-PA3F20R0V
R10 = Passives:41.2KOHM; DEVICE: 41.2KOHM-0603-1/10-0.1%; MFG: Panasonic; PACKAGE: 0603; PN: ERA-3AEB4122V
R11 = Passives:7.68KOHM; DEVICE: 7.68KOHM-0603-1/5-0.1%; MFG: Panasonic; PACKAGE: 0603; PN: ERJ-PB3B7681V
R12 = Passives:51KOHM; DEVICE: 51KOHM-0603-1/10-0.5%; MFG: Panasonic; PACKAGE: 0603; PN: ERJ-3RBD5102V
R14-R16 = Passives:4.7KOHM; DEVICE: 4.7KOHM-0603-1/4-1%; MFG: Panasonic; PN: ERJ-PA3F4701V
R18 R30 R31 = Passives:150OHM; DEVICE: 150OHM-0603-1/4-1%; MFG: Panasonic; PACKAGE: 0603; PN: ERJ-PA3F1500V
R19 R32 R33 = Passives:100OHM; DEVICE: 100OHM-0603-1/4-1%; MFG: Panasonic; PACKAGE: 0603; PN: ERJ-PA3F1000V
R29 = Passives:18KOHM; DEVICE: 18KOHM-0603-1/10-1%; MFG: Panasonic; PACKAGE: 0603; PN: ERJ-3RBD1802V
SH1 = shorts:SHORT: Short between two nets; BOM: no
SW1 = Passives:CHS-01TA1; DEVICE: CHS-01TA1; MFG: Nidec; PN: CHS-01TA1
TX = Passives:LED_RED: 0805 Red LED; MFG: Wurth Elektronik; PN: 150080RS75000
U1 = ICs:MPQ4420; MFG: Monolithic Power Systems; PN: MPQ4420GJ-AEC1-Z
U2 = ICs:TH3122.4: The TH3122 consists of a low drop voltage regulator 5V/100mA and a K-Bus transceiver. The transceiver is suitable for K-Bus systems conform to ISO 9141.; MFG: Melexis; PN: TH3122.4
U3 = ICs:FT231X: FTDI FT231X Full Speed USB to Full-handshake UART; MFG: FTDI; PN: FT231XS-R
U4 = ICs:S-1212BC0; MFG: Ablic; PN: S-1212BC0-M5T1U
U5 = ICs:XC6210: 3.3v Voltage Regulator; MFG: Torex; PN: XC6210A332MR-G
U6 = ICs:CAT25128; MFG: ONSEMI; PN: CAT25128YI-GT3
U7 = ICs:PIC24FJ1024GA606; MFG: Microchip; PN: PIC24FJ1024GA606T-I/PT
U8 = ICs:BM83SM1: BM83 Bluetooth Module; HEIGHT: 2.5mm; MFG: Microchip; PN: BM83SM1
U9 = ICs:DIT4096; MFG: Texas Instruments; PN: DIT4096IPW
U10 = ICs:PCM5122: The PCM512x devices are a family of monolithic CMOS-integrated circuits that include a stereo digitalto-analog converter.; MFG: Texas Instruments; PN: PCM5122PW
U11 = ICs:PAM8406; MFG: Diodes; PN: PAM8406DR

## Net classes
0 default: width 0.25 mm, drill 0.51 mm
1 5V: width 0.55 mm, drill 0.51 mm
2 3.3V: width 0.22 mm, drill 0.51 mm
3 VIN: width 0.3 mm, drill 0.51 mm
4 Data: width 0.25 mm, drill 0.51 mm
5 MCU_Data: width 0.22 mm, drill 0.51 mm
6 USB_5V: width 0.25 mm, drill 0.51 mm
7 MCU_3V3: width 0.22 mm, drill 0.51 mm

## Board
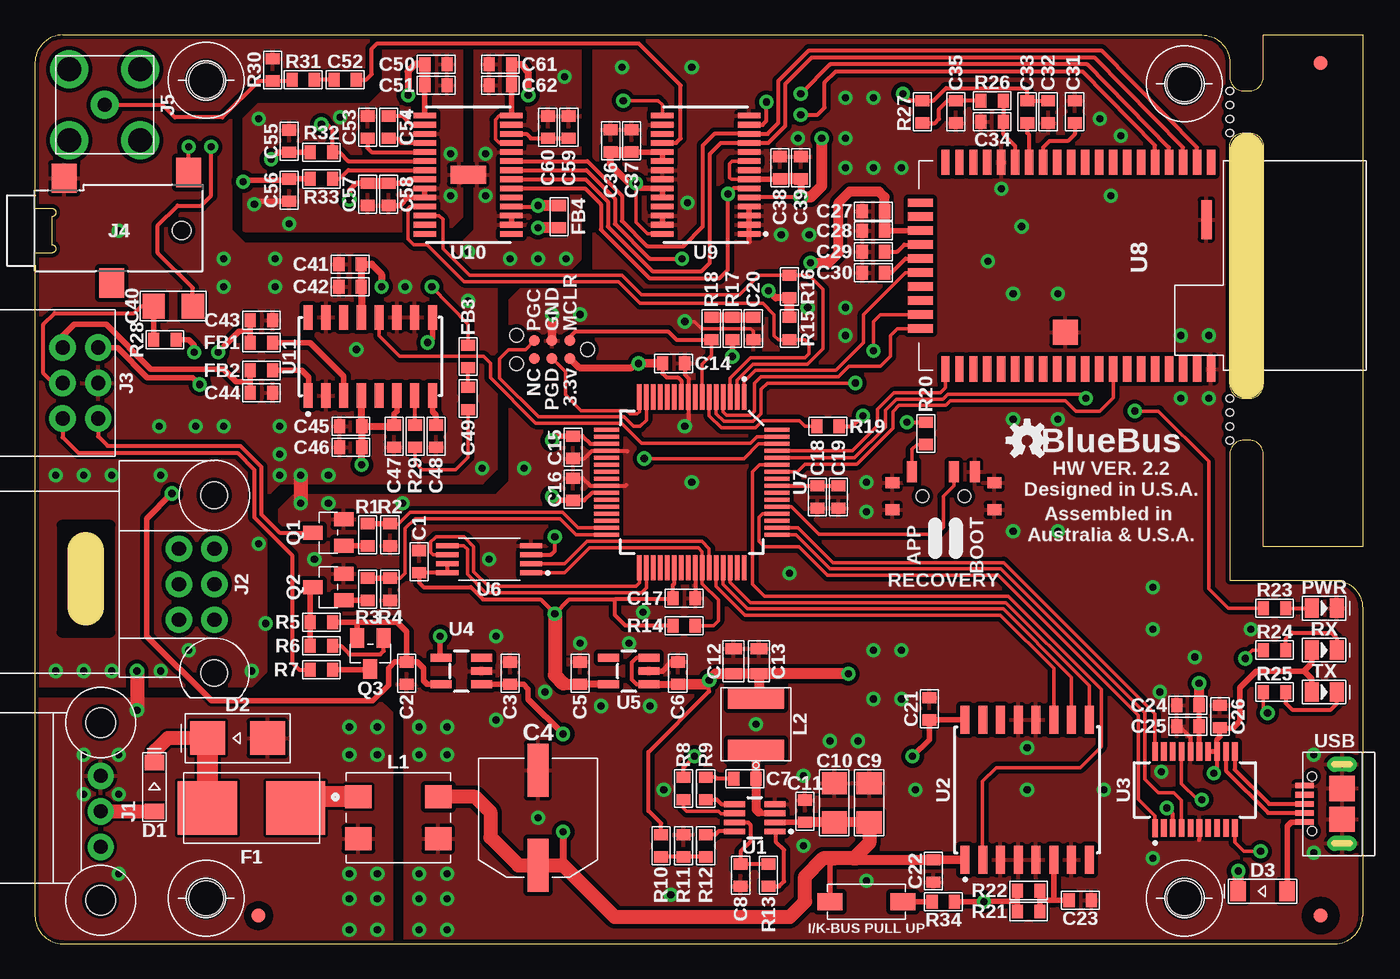
[diagram p5: board, top side]
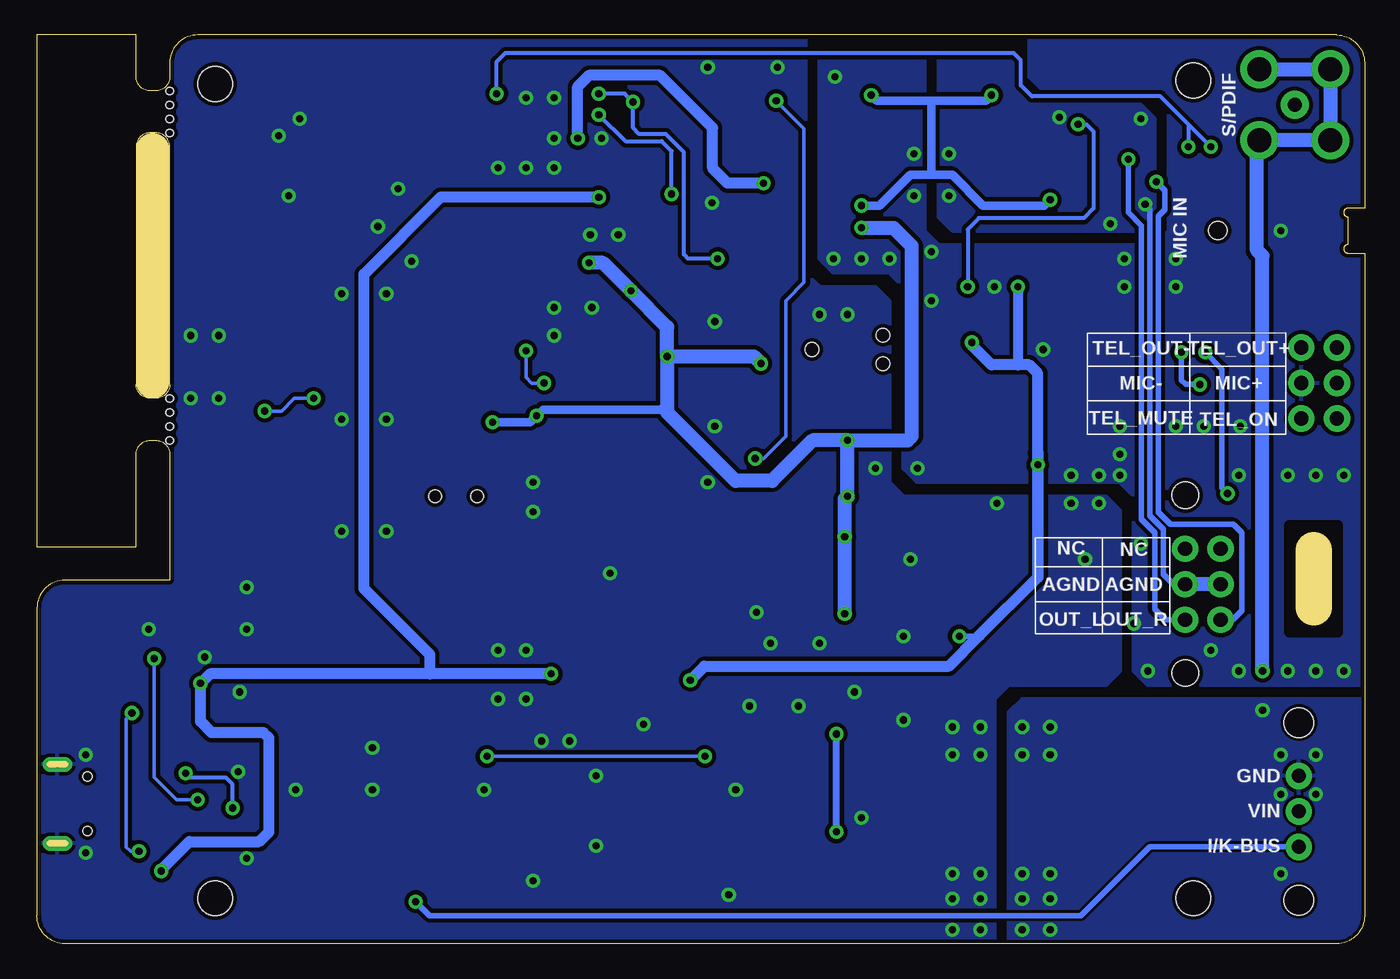
[diagram p6: board, bottom side, seen from below]

Size 95 x 65 mm. Coordinates in mm from the lower left corner, seen from the top.
Outline: 2,0 93,0 arc90 95,2 95,24 arc90 93,26 85.5,26 85.5,35 arc-90 86.5,36 86.9,36 arc-90 87.9,35 87.9,28.4 95,28.4 95,65 87.9,65 87.9,62 arc-90 86.9,61 86.5,61 arc-90 85.5,62 85.5,63 arc90 83.5,65 2,65 arc90 0,63 0,52.6 1.2,52.6 arc-90 1.5,52.3 arc-90 1.2,52 1.2,50 arc-90 1.5,49.7 arc-90 1.2,49.4 0,49.4 0,2 arc90 2,0
Outline: 85.5,40 85.5,57 arc-90 86.5,58 86.9,58 arc-90 87.9,57 87.9,40 arc-90 86.9,39 86.5,39 arc-90 85.5,40
Copper layers (1*16): Top 0.035mm / dielectric 1.5mm / Bottom 0.035mm
Design rules "SparkFun_Metric *": minimum track width 0.25mm, minimum drill 0.5mm, track to track 0.2mm, track to pad 0.2mm, pad to pad 0.2mm, via to via 0.2mm, smd to smd 0.2mm, copper to edge 0.25mm, drill to drill 0.2mm, minimum pad ring 0.3mm, minimum via ring 0.25mm, stop-mask expansion 0.1mm, vias tented up to drill 25mil, thermal gap 0.25mm
Holes 0.51 mm at 85.5,58 85.5,59 85.5,60 85.5,61 85.5,36 85.5,37 85.5,38 85.5,39
Milling: 1 lines

### Footprints (pad centres in the part's own frame; a part is rotated, then mirrored left to right if it is on the bottom)
0603 = smd 0.8 x 1: 1 -0.8,0; 2 0.8,0
RHS1V101MCN1GS = smd 3.8 x 1.5: 1 -3.4,0; 2 3.4,0
1206 = smd 1.6 x 1.8: 1 -1.4,0; 2 1.4,0
0805 = smd 0.8 x 1.2: 1 -0.9,0; 2 0.9,0
SOD123FL-2 = smd 1.1 x 1.4: A 1.75,0; C -1.75,0
DO-214AA = smd 2.5 x 2.4: A -2.15,0; C 2.15,0
LITTLEFUSE = smd 3.81 x 4.242: IN 0,3.151; OUT 0,-3.151
FIDUCIAL_1MM = smd 1 x 1: P$1 0,0
2.5-HOLE = hole 2.5: 0,0
TE_MQS_3PIN = drill 1 pad 1.88: 1 0,0; 2 2.54,0; 3 5.08,0 | hole 2.1: -3.81,0; 8.89,0
TE_MQS_6PIN = drill 1.016 pad 1.88: 1 5.08,2.54; 2 2.54,2.54; 3 0,2.54; 4 5.08,0; 5 2.54,0; 6 0,0 | hole 1.9: -3.81,2.54; 8.89,2.54
TE_AMPMODU_6_PIN = drill 1.016 pad 1.88: 1 -2.54,-1.27; 2 -2.54,1.27; 3 0,-1.27; 4 0,1.27; 5 2.54,-1.27; 6 2.54,1.27
CUI_SJ2_35853A_SMT_TR = smd 1.8 x 2.1: 1 -3.9,3.75; 2 5,4.15; 3 -0.5,-3.75 | hole 1.3: 4.5,0
MOLEX_SMB = drill 1.7 pad 2.7: 1 -2.54,2.54; 2 2.54,2.54; 3 2.54,-2.54; 4 -2.54,-2.54 | drill 1 pad 2: P$1 0,0
USB3080-30-01-A = smd 0.4 x 1.35: 1 -1.3,0; 2 -0.65,0; 3 0,0; 4 0.65,0; 5 1.3,0 | drill 0.45 pad 1.075 long: MNT1 -2.825,-2.68; MNT2 2.825,-2.68 | smd 1.8 x 1.8: MNT3 -1.1,-2.68; MNT4 1.1,-2.68 | hole 0.65: -1.95,-0.53; 1.95,-0.53
PCM12SMTR = smd 0.7 x 1.5: 1 -2.25,1.75; 2 0.75,1.75; 3 2.25,1.75 | smd 1 x 0.8: 4 -3.65,0.965; 5 -3.65,-0.965; 6 3.65,-0.965; 7 3.65,0.965 | hole 0.9: 1.5,0; -1.5,0
TC2030-NL = smd 0.787 x 0.787: 1 -1.27,-0.635; 2 -1.27,0.635; 3 0,-0.636; 4 0,0.635; 5 1.27,-0.635; 6 1.27,0.635 | hole 1: 2.54,1.016; 2.54,-1.016; -2.54,0
ACM70V-701-2PL-TL00 = smd 1.905 x 1.651: 1 -2.857,1.5; 2 -2.857,-1.5; 3 2.857,-1.5; 4 2.857,1.5
MPL-SE5040 = smd 1.5 x 4: 1 1.85,0; 2 -1.85,0
LED-0805 = smd 1 x 1.4: + -0.9,0; - 0.9,0
SOT-23 = smd 1 x 1.4: 1 -0.95,-1.1; 2 0.95,-1.1; 3 0,1.1
SHORT_TOP-50 = smd 1.27 x 1.27: 1 0.635,0; 2 -0.635,0
CHS-01TA1 = smd 1.2 x 1.8: 1 0,-2.6; 2 0,2.6
TSOT23-8 = smd 0.4 x 1.5: 1 -0.975,-1.45; 2 -0.325,-1.45; 3 0.325,-1.45; 4 0.975,-1.45; 5 0.975,1.45; 6 0.325,1.45; 7 -0.325,1.45; 8 -0.975,1.45
SOIC16DF = smd 0.635 x 2: 1 -4.45,-5; 2 -3.18,-5; 3 -1.91,-5; 4 -0.64,-5; 5 0.63,-5; 6 1.9,-5; 7 3.17,-5; 8 4.44,-5; 9 4.44,5; 10 3.17,5; 11 1.9,5; 12 0.63,5; 13 -0.64,5; 14 -1.91,5; 15 -3.18,5; 16 -4.45,5
SSOP20_L = smd 0.4 x 1.3: 1 -2.857,-2.75; 11 2.857,2.75; 12 2.223,2.75; 13 1.587,2.75; 14 0.953,2.75; 15 0.318,2.75; 16 -0.318,2.75; 17 -0.953,2.75; 18 -1.587,2.75; 19 -2.223,2.75; 20 -2.857,2.75 | smd 0.4 x 1.25: 2 -2.223,-2.725; 3 -1.587,-2.725; 4 -0.953,-2.725; 5 -0.318,-2.725; 6 0.318,-2.725; 7 0.953,-2.725; 8 1.587,-2.725; 9 2.223,-2.725; 10 2.857,-2.725
SOT23-5 = smd 0.55 x 1.5: 1 -0.95,-1.45; 2 0,-1.45; 3 0.95,-1.45; 4 0.95,1.45; 5 -0.95,1.45
TSSOP-8 = smd 1.6 x 0.35: 1 -3,0.975; 2 -3,0.325; 3 -3,-0.325; 4 -3,-0.975; 5 3,-0.975; 6 3,-0.325; 7 3,0.325; 8 3,0.975
TQFP64 = smd 0.3 x 1.8: 1 -3.75,-6.1; 2 -3.25,-6.1; 3 -2.75,-6.1; 4 -2.25,-6.1; 5 -1.75,-6.1; 6 -1.25,-6.1; 7 -0.75,-6.1; 8 -0.25,-6.1; 9 0.25,-6.1; 10 0.75,-6.1; 11 1.25,-6.1; 12 1.75,-6.1; 13 2.25,-6.1; 14 2.75,-6.1; 15 3.25,-6.1; 16 3.75,-6.1; 33 3.75,6.1; 34 3.25,6.1; 35 2.75,6.1; 36 2.25,6.1; 37 1.75,6.1; 38 1.25,6.1; 39 0.75,6.1; 40 0.25,6.1; 41 -0.25,6.1; 42 -0.75,6.1; 43 -1.25,6.1; 44 -1.75,6.1; 45 -2.25,6.1; 46 -2.75,6.1; 47 -3.25,6.1; 48 -3.75,6.1 | smd 1.8 x 0.3: 17 6.1,-3.75; 18 6.1,-3.25; 19 6.1,-2.75; 20 6.1,-2.25; 21 6.1,-1.75; 22 6.1,-1.25; 23 6.1,-0.75; 24 6.1,-0.25; 25 6.1,0.25; 26 6.1,0.75; 27 6.1,1.25; 28 6.1,1.75; 29 6.1,2.25; 30 6.1,2.75; 31 6.1,3.25; 32 6.1,3.75; 49 -6.1,3.75; 50 -6.1,3.25; 51 -6.1,2.75; 52 -6.1,2.25; 53 -6.1,1.75; 54 -6.1,1.25; 55 -6.1,0.75; 56 -6.1,0.25; 57 -6.1,-0.25; 58 -6.1,-0.75; 59 -6.1,-1.25; 60 -6.1,-1.75; 61 -6.1,-2.25; 62 -6.1,-2.75; 63 -6.1,-3.25; 64 -6.1,-3.75
BM83SM1 = smd 1.8 x 0.6: 1 0.1,20.9; 2 0.1,19.9; 3 0.1,18.9; 4 0.1,17.9; 5 0.1,16.9; 6 0.1,15.9; 7 0.1,14.9; 8 0.1,13.9; 9 0.1,12.9; 10 0.1,11.9; 11 0.1,10.9; 12 0.1,9.9; 13 0.1,8.9; 14 0.1,7.9; 15 0.1,6.9; 16 0.1,5.9; 17 0.1,4.9; 18 0.1,3.9; 19 0.1,2.9; 20 0.1,1.9; 31 14.9,1.9; 32 14.9,2.9; 33 14.9,3.9; 34 14.9,4.9; 35 14.9,5.9; 36 14.9,6.9; 37 14.9,7.9; 38 14.9,8.9; 39 14.9,9.9; 40 14.9,10.9; 41 14.9,11.9; 42 14.9,12.9; 43 14.9,13.9; 44 14.9,14.9; 45 14.9,15.9; 46 14.9,16.9; 47 14.9,17.9; 48 14.9,18.9; 49 14.9,19.9; 50 14.9,20.9 | smd 0.6 x 1.8: 21 3,0.1; 22 4,0.1; 23 5,0.1; 24 6,0.1; 25 7,0.1; 26 8,0.1; 27 9,0.1; 28 10,0.1; 29 11,0.1; 30 12,0.1 | smd 2.79 x 0.76: EP1 4.21,20.58 | smd 1.78 x 1.78: EP2 12.27,10.47
TSSOP28 = smd 1.6 x 0.4: 1 -3.1,4.225; 2 -3.1,3.575; 3 -3.1,2.925; 4 -3.1,2.275; 5 -3.1,1.625; 6 -3.1,0.975; 7 -3.1,0.325; 8 -3.1,-0.325; 9 -3.1,-0.975; 10 -3.1,-1.625; 11 -3.1,-2.275; 12 -3.1,-2.925; 13 -3.1,-3.575; 14 -3.1,-4.225; 15 3.1,-4.225; 16 3.1,-3.575; 17 3.1,-2.925; 18 3.1,-2.275; 19 3.1,-1.625; 20 3.1,-0.975; 21 3.1,-0.325; 22 3.1,0.325; 23 3.1,0.975; 24 3.1,1.625; 25 3.1,2.275; 26 3.1,2.925; 27 3.1,3.575; 28 3.1,4.225
SOP-16 = smd 0.65 x 1.75: 1 -4.45,-2.8; 2 -3.18,-2.8; 3 -1.91,-2.8; 4 -0.64,-2.8; 5 0.63,-2.8; 6 1.9,-2.8; 7 3.17,-2.8; 8 4.44,-2.8; 9 4.44,2.8; 10 3.17,2.8; 11 1.9,2.8; 12 0.63,2.8; 13 -0.64,2.8; 14 -1.91,2.8; 15 -3.18,2.8; 16 -4.45,2.8

### Placement (x,y rotation side)
C1  27.5,27.32 90 top
C2  26.6,19.35 270 top
C3  34,19.35 90 top
C4  36,9 90 top
C5  39,19.35 90 top
C6  46,19.35 90 top
C7  50.8,11.8 0 top
C8  50.5,4.9 270 top
C9  59.7,10.07 90 top
C10  57.2,10.07 90 top
C11  55.1,9.47 90 top
C12  50,20.2 90 top
C13  51.8,20.2 90 top
C14  45.7,41.5 180 top
C15  38.5,35.5 90 top
C16  38.5,32.5 270 top
C17  46.45,24.7 180 top
C18  56,31.95 270 top
C19  57.5,31.95 270 top
C20  51.4,44 270 top
C21  64,16.8 270 top
C22  64.3,5.2 270 top
C23  74.8,3.1 0 top
C24  82.5,17.05 180 top
C25  82.5,15.55 180 top
C26  84.8,16.25 90 top
C27  60,52.4 180 top
C28  60,51 180 top
C29  60,49.5 180 top
C30  60,48 180 top
C31  74.4,59.5 270 top
C32  72.5,59.5 270 top
C33  71,59.5 270 top
C34  68.5,58.8 180 top
C35  65.9,59.5 270 top
C36  41.2,57.42 90 top
C37  42.7,57.42 90 top
C38  53.3,55.5 90 top
C39  54.8,55.5 90 top
C40  9.9,45.6 180 top
C41  22.55,48.6 180 top
C42  22.55,47 180 top
C43  16.2,44.6 0 top
C44  16.2,39.4 0 top
C45  22.6,37 180 top
C46  22.6,35.5 180 top
C47  25.7,36.3 270 top
C48  28.7,36.3 270 top
C49  31,39 270 top
C50  28.7,62.9 0 top
C51  28.7,61.4 0 top
C52  22.2,61.8 180 top
C53  23.8,58.4 270 top
C54  25.3,58.4 270 top
C55  18.2,57.4 90 top
C56  18.2,53.9 270 top
C57  23.8,53.6 270 top
C58  25.3,53.6 270 top
C59  38.2,58.4 90 top
C60  36.7,58.4 90 top
C61  33.3,62.9 180 top
C62  33.3,61.4 180 top
D1  8.55,11.2 270 top
D2  14.5,14.7 180 top
D3  87.85,3.75 0 top
F1  15.5,9.7 90 top
FB1  16.2,43 180 top
FB2  16.2,41 180 top
FB3  31,42 270 top
FB4  37.5,52 90 top
FID1  16,2 0 top
FID2  92,2 0 top
FID3  92,63 0 top
FRAME1  50,66 0 top
FRAME2  47.5,66 0 top
FRAME3  45,66 0 top
FRAME4  42.5,66 0 top
FRAME5  40,66 0 top
H1  12.25,3.25 0 top
H2  12.25,61.75 0 top
H3  82.25,61.5 0 top
H4  82.25,3.25 0 top
J1  4.7,12 270 top
J2  10.3,28.25 270 top
J3  3.25,40.1 270 top
J4  6,51 0 top
J5  5,60 180 top
J6  90.85,10 90 top
J7  65,32 0 top
J8  37,42.5 180 top
L1  26,9 0 top
L2  51.6,15.7 270 top
PWR  92.25,24 0 top
Q1  21,29.4 90 top
Q2  21,25.5 90 top
Q3  24,20.75 180 top
R1  23.8,29.25 270 top
R2  25.4,29.25 270 top
R3  23.8,25.35 270 top
R4  25.4,25.35 90 top
R5  20.5,23 0 top
R6  20.5,21.3 0 top
R7  20.5,19.6 180 top
R8  46.4,11.1 90 top
R9  48,11.1 90 top
R10  44.8,7 90 top
R11  46.4,7 270 top
R12  48,7 90 top
R13  52.5,4.9 90 top
R14  46.45,22.75 180 top
R15  54,44 90 top
R16  54,47 270 top
R17  49.9,44 90 top
R18  48.4,44 270 top
R19  56.75,37 0 top
R20  63.75,36.5 90 top
R21  71.1,2.3 0 top
R22  71.1,3.8 0 top
R23  88.7,24 180 top
R24  88.7,21 180 top
R25  88.7,18 180 top
R26  68.5,60.3 0 top
R27  63.5,59.5 270 top
R28  9.3,43.2 180 top
R29  27.2,36.3 90 top
R30  17,62.5 90 top
R31  19.2,61.8 180 top
R32  20.5,56.6 180 top
R33  20.5,54.7 180 top
R34  65,3 180 top
RX  92.25,21 0 top
SH1  31,55 0 top
SW1  59.5,3 90 top
TX  92.25,18 0 top
U1  51.5,9 90 top
U2  71,11 0 top
U3  83,11 0 top
U4  30.5,19.5 90 top
U5  42.5,19.5 90 top
U6  32.5,27.5 180 top
U7  47,33 180 top
U8  63.25,56 270 top
U9  48,55 180 top
U10  31,55 0 top
U11  24,42 0 top
U$1  [OSHW-LOGO-S]  71,36 0 top

### Tracks (layer width: path | path; a pad name or v marks a point on that pad's centre or on a via)
3.3V  (via drill 0.51)
  Top 0.3: v62.4,37.3 R20.2 | U7.38 45.75,25.75 45.65,25.65 C17.2 45.58,24.62 41.5,24.62 | 41.5,24.62 38.23,24.62 v37.2,23.6 36.17,24.62 32.07,24.62 31.19,25.5 27.8,25.5 27.5,25.8 C1.1 U6.8 U6.7 | R14.2 42.25,22.75 41.5,23.5 41.5,24.62 | U7.26 39.85,32.25 39.3,31.7 C16.2 | C15.2 39.2,36.3 39.75,35.75 U7.19 | C14.2 44.9,40.8 45.2,40.5 46,40.5 46.25,40.25 U7.10 | U6.3 36.92,27.82 37.2,28.1 v37.2,29.1 | 43.1,41.6 v43.2,41.5 | v59.25,37.75 58.5,37 R19.2
  Top 0.4: C28.1 U8.23 | R17.1 v49.9,42 | v37,32 37.3,31.7 C16.2 | C15.2 37.3,36.3 v37,36
  Top 0.5: U5.5 C5.1 | R16.2 53,46.2 v52.5,46.7 | J8.2 38.94,41.2 42.7,41.2 43.1,41.6
  Top 0.6: C14.2 v43.2,41.5
  Top 0.7: C27.1 60.8,53.4 60.4,53.8 58.3,53.8 57.5,53 57.5,49.4 56.8,48.7 v55.5,48.7 | R15.2 R16.2 | 37.8,18.6 37.85,18.55
  Top 0.8: C27.1 C28.1 | 37.85,18.55 C5.1 | FB4.1 v36,51.2
  Top 1: 37.8,18.6 37.2,19.2 v37.2,23.6
  Bottom 0.6: v62.4,37.3 59.7,37.3 v59.25,37.75 58.8,38.2 50.2,38.2
  Bottom 0.8: 49.9,38 50.2,38.2
  Bottom 1: v37.2,23.6 v37.2,29.1 37.2,31.8 v37,32 v37,36 | v55.5,48.7 54.5,48.7 v52.5,46.7 49.9,44.1 v49.9,42 | v37,36 32.7,36 32.4,36.3 32.4,49.9 33.7,51.2 v36,51.2 | v49.9,42 49.9,38 45,33.1 42.4,33.1 39.5,36 v37,36 | v49.9,42 43.7,42 v43.2,41.5
5V  (via drill 0.51)
  Top 0.25: U9.9 49.88,55.98 49.7,55.8 49.7,54.8 49.83,54.67 U9.7 | U9.28 43.83,50.77 43,51.6 v43,54.4
  Top 0.3: U5.3 43.05,20.45 42.7,20.1 42.7,18.9 43.05,18.55 U5.1 | v48.25,18.85 48.25,18.05 43.9,13.7 43.9,9.5 44.8,8.6 R10.2 | 54.77,53.38 U9.5
  Top 0.35: U3.15 83.3,13.74 C25.1 C24.1
  Top 0.4: U11.6 25.9,38.1 25.7,37.9 C47.1 | U11.9 28.44,43.34 v28.1,43 | U9.7 53.27,54.67 | U9.20 U9.19 C37.1 | U9.24 U9.23 43.38,54.02 v43,54.4 | U4.4 29,20.5 v29,22
  Top 0.5: C47.1 25.6,37 C45.1 | U11.13 C42.1 C41.1 24.1,48.6 24.8,47.9 v24.8,47 | U5.1 C6.1 | v43,54.4 42.5,54.4 41.2,55.7 C36.1 | C39.1 v54.8,53.4 54.77,53.38 | C45.1 C46.1 23.38,35.48 v23.38,34.25 | C45.1 23.36,37.04 U11.4
  Top 0.7: C12.1 C13.1 51.8,17.75 L2.2 | 47.95,18.55 v48.25,18.85 | v83.3,18.62 C24.1
  Top 0.75: C12.1 48.7,19.3 v48.25,18.85 | C6.1 47.95,18.55
  Top 0.8: v58.2,19.3 C13.1 | D3.C v86.1,5.2 | v54.8,53.4 55.5,53.4 56.3,54.2 v56.3,57.6 | C39.1 C38.1 53.27,54.67 | C36.1 C37.1
  Bottom 0.4: v29,22 27.6,22 27.55,22.05
  Bottom 0.7: 23.39,35 23.38,35.1 | v24.8,47 24.8,41.4
  Bottom 0.8: 23.38,26.22 27.55,22.05 29.74,19.86 47.24,19.86 v48.25,18.85 | v86.1,5.2 86.1,5.3 84.1,7.3 79.1,7.3 78.4,8 78.4,14.7 78.8,15.1 82.5,15.1 83.3,15.9 v83.3,18.62 82.62,19.3 66.9,19.3 | 66.9,19.3 66.9,20.7 71.6,25.4 71.6,47.9 66.1,53.4 v54.8,53.4 | v58.2,19.3 66.9,19.3 | 23.39,35 23.39,40.8 23.99,41.4 24.8,41.4 26.7,41.4 28.1,42.8 v28.1,43 | v43,54.4 45.6,54.4 46.65,55.45 46.65,58.35 50.4,62.1 55.5,62.1 56.3,61.3 v56.3,57.6
  Bottom 0.813: 23.38,35.1 v23.38,34.25 23.38,26.22
5VREG_BS
  Top 0.3: R9.1 48.8,10.3 49.12,9.97 U1.5
5VREG_BS_CAP
  Top 0.3: C7.1 48.8,11.8 48.7,11.9 R9.2
5VREG_EN
  Top 0.25: U1.6 50.02,9.3 49.1,9.3 48.93,9.47 46.63,9.47 46.4,9.7 R8.1
5VREG_FB
  Top 0.3: U1.8 48.92,8.03 48.7,7.8 R12.2
5VREG_FB_T
  Top 0.3: R12.1 R11.2 R10.1
5VREG_PG
  Top 0.3: U1.1 53,7.97 53,7.3 53.6,6.7 53.6,4.45 53.25,4.1 R13.1
5VREG_SW
  Top 0.4: U1.3 51.88,9.32 51.8,9.4
  Top 0.6: L2.1 C7.2
  Top 0.65: 51.8,9.4 51.6,9.6 C7.2
5VREG_VCC
  Top 0.3: U1.7 51.02,8.68 51.2,8.5 51.2,7.3 50.5,6.6 C8.1 R13.2
12V  (via drill 0.51)
  Top 0.4: v9.8,32.2 8,30.4 8,22 12.64,17.36 24.16,17.36 25.3,18.5 25.3,19.7 25.75,20.15 C2.1 | R28.1 11,43.2 11.4,42.8 v11.4,42.3 | R5.2 23,23 | 23,23 25.9,23 26.6,22.3 C2.1 | U4.5 28.05,18.55 27.8,18.8 27.8,19.7 27.35,20.15 C2.1 | Q3.2 23.05,22.95 23,23
  Bottom 0.4: v9.8,32.2 10.2,32.6 10.2,41.1 v11.4,42.3
AGND  (via drill 0.51)
  Top 0.4: 30.37,54.6 30.48,54.48 | v15.7,52.9 15.9,53.1 C56.2 | U10.9 U10.10 26.68,53.38 26.1,52.8 C58.2
  Bottom 0.4: J2.2 13.7,25.71 14.4,26.41 14.4,29.65 15.36,30.61 15.36,52.56 v15.7,52.9
  Bottom 1: J2.5 J2.2
  other vias: 29.75,56.5 16,59 29.75,53.5 18.2,51.5 21.85,59.1
  pour Bottom (isolate 0.3): 30.5,65 30.5,52 29.5,51 15.1,51 15,51.04 15,59 16,60 24,60 25,61 25,65
  pour Top (isolate 0.3): 30.5,65 30.5,52 29.5,51 15.1,51 15,51.04 15,59 16,60 24,60 25,61 25,65
BT_MFB
  Top 0.25: U7.1 50.75,40.18 51.57,41 57.3,41 59.3,43 59.3,45 62.3,48 U8.26
BT_MIC_L  (via drill 0.51)
  Top 0.3: C40.1 11.3,46.9 8.8,49.4 8.8,51.4 10.2,52.8 11.9,52.8 12.6,53.5 v12.6,57 | C32.1 C33.1 71,61 70.8,61.2 65.19,61.2 64.29,60.3 R27.1 62.6,60.3 v62.1,60.8 | J4.2 v11,57
  Bottom 0.3: 12.6,58.6 14.6,60.6 23.8,60.6 24.6,61.4 24.6,63.2 25.1,63.7 61.5,63.7 62.1,63.1 v62.1,60.8 | 12.6,58.6 v12.6,57 | 12.6,58.6 v11,57
BT_MODE
  Top 0.25: U7.61 58.51,35.25 60.3,37.04 60.3,38.24 61.46,39.4 64.8,39.4 65.15,39.75 U8.31
BT_RST
  Top 0.25: U8.43 77.15,39.05 76.2,38.1 74.5,38.1 73.75,38.85 65.52,38.85 65.17,38.5 61.84,38.5 61.4,38.06 61.4,36.86 58.84,34.3 55.1,34.3 54.55,33.75 U7.58
BT_SYS_PWR
  Top 0.3: C29.1 61.7,49.5 62.2,50 U8.24
BT_URX
  Top 0.25: U7.4 49.25,38.05 49.5,37.8 51.2,37.8 51.5,38.1 51.5,40.09 51.96,40.55 57.49,40.55 58.24,41.3 60.5,41.3 61.2,42 61.2,43.5 61.7,44 U8.30
BT_UTX  (via drill 0.51)
  Top 0.25: v60,42.4 60,44.5 60.5,45 U8.29 | v58.7,40.1 52.4,40.1 51.95,39.65 51.95,37.91 51.39,37.35 49.31,37.35 48.75,37.91 U7.5
  Bottom 0.25: v60,42.4 60,40.5 59.6,40.1 v58.7,40.1
BT_VDD_IO
  Top 0.3: C30.1 61.3,48 62.3,49 U8.25
DAC_3V3  (via drill 0.51)
  Top 0.25: U10.28 33.23,59.23 32.95,58.95 32.95,57.55 33.23,57.27 U10.25
  Top 0.3: U10.18 35.92,52.73 v36,52.8
  Top 0.4: C62.1 U10.28 | C51.1 U10.1 | C58.1 26.6,54.4 26.88,54.67 U10.8 | C57.1 23,54.4 22.5,53.9 v22.5,53.2
  Top 0.5: C50.1 27.2,62.9 26.7,62.4 v26.7,60.7 | C61.1 34.85,62.9 35.3,62.3 v35.3,60.7
  Top 0.8: C61.1 C62.1 | C50.1 C51.1 | C57.1 C58.1 | FB4.2 v36,52.8
  Bottom 0.6: v36,52.8 34.7,52.8 32.5,55 31.1,55 | 31.1,55 31,55.1 31,60.3 | v22.5,53.2 22.9,52.8 27.3,52.8 29.5,55 31.1,55 | v26.7,60.7 27.1,60.3 31,60.3 | v35.3,60.7 34.9,60.3 31,60.3
DAC_CAPM
  Top 0.3: C54.2 25.9,57.6 26.23,57.27 U10.4
DAC_CAPP
  Top 0.3: U10.2 26.93,58.58 26.3,59.2 C54.1
DAC_LDOO
  Top 0.3: U10.26 35.17,57.92 35.5,57.6 C60.1 C59.1
DAC_OUT_L  (via drill 0.51)
  Top 0.25: v28.4,47 31,44.3 FB3.1
  Top 0.3: U10.6 22.43,55.98 21.8,56.6 R32.1 21.3,58.2 20.9,58.6 v20.5,58.6
  Bottom 0.3: v20.5,58.6 19.9,58.6 19.4,58.1 19.4,52.6 20.1,51.9 27.6,51.9 28.4,51.1 v28.4,47
DAC_OUT_R
  Top 0.3: U10.7 22.43,55.33 21.8,54.7 R33.1
DAC_VNEG
  Top 0.3: C53.2 23.8,56.9 24.07,56.62 U10.5
EE_CS
  Top 0.25: R14.1 48.55,22.75 48.9,23.1 48.9,24.6 47.75,25.75 U7.42 47.75,28.05 47.48,28.32 39.7,28.32 37.9,26.52 U6.1
EE_SCK
  Top 0.25: U7.33 43.25,25.8 43,25.55 32.45,25.55 31.4,26.6 31.4,28.4 30.7,29.1 28.7,29.1 28.57,28.98 28.32,28.73 28.32,28 28.5,27.82 U6.6
EE_SI
  Top 0.25: U7.34 43.75,25.45 43.4,25.1 32.26,25.1 30.95,26.41 30.95,28.21 30.69,28.48 U6.5
EE_SO
  Top 0.25: U7.43 48.25,28.25 47.73,28.77 39.51,28.77 37.91,27.18 U6.2
GND  (via drill 0.51)
  Top 0.25: v46.5,44.5 47.2,44.5 47.7,44 51.2,44 51.4,43.8 C20.2
  Top 0.3: U3.6 83.32,7.42 | C25.2 81.91,15.55 82.68,14.77 U3.16 | U7.41 C17.1 | C16.1 39.2,33.3 39.75,32.75 U7.25 42.25,32.75 42.3,32.8 | C15.1 39.3,34.7 39.85,35.25 U7.20 42.35,35.25 42.4,35.2 | C14.1 46.5,40.71 46.75,40.46 U7.9 46.75,37.25 v46.5,37
  Top 0.4: U5.2 44.9,19.5 45.55,20.15 C6.2 | U9.4 U9.3 U9.2 U9.1 51.1,50.2 | U9.27 U9.26 | U10.17 U10.16
  Top 0.6: v37,45 J8.3
  Top 1: v19,33.5 v19,31.5
  other vias: 80.6,12.3 1.5,19.5 3.5,19.5 5.5,19.5 1.5,33.5 3.5,33.5 59.5,33 59.5,30.9 31,46 13.5,37 17.5,37 47,33 35,34 80,6.1 83,20.5 71,11 71,14 27.5,3.2 29.5,5 27.5,5 29.5,3.2 27.5,15.5 29.5,15.5 36,9 29.5,13.5 27.5,13.5 51.6,15.7 45,11 32.5,27.5 33,22 42.5,21.5 40.5,17 62,55.5 60,55.5 82,43.5 77.7,57.8 60,60.5 69.15,54 77,53.5 70.6,51.3 58,45.5 70,46.5 73.2,46.5 58,60.5 37.9,62 26.5,47 32.25,56.5 23,42.5 15.5,19.5 6,51 91.5,13.5 91.5,6.5 80,25.5 80,22.5 87,22.5 62,21 60,21 60,17.5 62,17.5 80.5,18 76.5,11 27.5,1 29.5,1 70,37.5 73.2,37.5 73.2,29.5 70,29.5 55,7 59.5,4.5 45.5,3.5 44,17 56.9,14.5 58.9,14.5 63,11 46.7,53 47,62.7 55.3,45.5 54.6,57.6 68.2,48.8 58,57.6 84,43.5 58,55.5 53.4,50.7 9,19.5 9,33.5 5.5,33.5 36.5,18 33,16 43.5,23.7 39,21.5 20,27.5 32,34 34,49 36,49 38,49 42,62.7 55.4,50.7 31,49.5 8.9,37 32.25,53.5 58,43.5 13.5,49 13.5,47 17.2,49 17.2,47 17.5,33.5 17.5,35 21,33.5 11.5,37 21,31.5 76.2,59 84,39 82,39 26.3,31.5 55,12 16,28.6 16.5,22.9 39,45 11,21 54,26.5
  pour Bottom (isolate 0.3): 0,18.5 15.5,18.5 16.5,19.5 16.5,32 17.5,33 32,33 33,34 33,47 34,48 38,48 39,49 39,65 31.5,65 31.5,51 30.5,50 15,50 14,51 14,60 15,61 23,61 24,62 24,65 2,65 arc90 0,63
  pour Top (isolate 0.3): 0,18.5 15.5,18.5 16.5,19.5 16.5,32 17.5,33 32,33 33,34 33,47 34,48 38,48 39,49 39,65 31.5,65 31.5,51 30.5,50 15,50 14,51 14,60 15,61 23,61 24,62 24,65 2,65 arc90 0,63
  pour Bottom (isolate 0.3): 26.5,0 93,0 arc90 95,2 95,24 arc90 93,26 85.5,26 85.5,63 arc90 83.5,65 40,65 40,48 39,47 35,47 34,46 34,33 33,32 18.5,32 17.5,31 17.5,19.5 18.5,18.5 25.5,18.5 26.5,17.5
  pour Top (isolate 0.3): 26.5,0 93,0 arc90 95,2 95,24 arc90 93,26 85.5,26 85.5,63 arc90 83.5,65 40,65 40,48 39,47 35,47 34,46 34,33 33,32 18.5,32 17.5,31 17.5,19.5 18.5,18.5 25.5,18.5 26.5,17.5
GND_FLT  (via drill 0.51)
  Top 1: v7.3,19.5 v7.3,16.7
  Bottom 1: J5.4 J5.3 J5.2 J5.1 7.7,57.3 7.7,49.6 7.3,49.2 v7.3,19.5
  other vias: 6,5 6,10.7 6,13.5 22.5,15.5 24.5,15.5 24.5,13.5 22.5,13.5 22.5,5 24.5,5 22.5,3.2 24.5,3.2 24.5,1 22.5,1 3.5,10.7 3.5,13.5
  pour Bottom: 25.5,0 2,0 arc-90 0,2 0,14.8 0,17.5 24.5,17.5 25.5,16.5
  pour Top: 25.5,0 2,0 arc-90 0,2 0,14.8 0,17.5 24.5,17.5 25.5,16.5
I2S_BCK
  Top 0.3: U8.3 82.15,56.95 75.8,63.4 55.6,63.4 53.7,61.5 53.7,58.5 52.48,57.27 U9.11 49.08,57.27 48.3,56.5 48.3,48.7 47.7,48.1 44.19,48.1 41,51.29 41,53.09 39.41,54.67 U10.21
I2S_DOUT  (via drill 0.51)
  Top 0.3: U10.22 39.47,55.33 41.5,53.29 41.5,51.49 43.99,49 v46.3,49 | U8.4 81.15,56.94 75.29,62.9 56.89,62.9 v54.8,60.8 | U9.13 52.08,58.58 52.34,58.84 v52.34,60.2
  Bottom 0.3: v54.8,60.8 52.94,60.8 v52.34,60.2 52.34,58.34 51.9,57.9 50,57.9 48.7,56.6 48.7,49.3 48.4,49 v46.3,49
I2S_LRCK
  Top 0.3: U10.23 39.52,55.98 42,53.5 42,51.7 43.8,49.9 46.4,49.9 47.8,51.3 47.8,57.1 48.62,57.92 U9.12 52.42,57.92 53.2,58.71 53.2,61.71 55.39,63.9 76.3,63.9 83.15,56.95 U8.2
I2S_MCLK  (via drill 0.51)
  Top 0.3: U8.5 80.15,57.1 74.95,62.4 57.3,62.4 56.5,61.6 56.5,59.8 56,59.3 v54.8,59.3 | U10.20 39.35,54.02 40.5,52.88 40.5,51.08 43.98,47.6 49,47.6 49.59,48.19 v49.59,53.62 49.99,54.02 U9.6
  Bottom 0.3: v49.59,53.62 49.59,56.69 50.3,57.4 52.9,57.4 v54.8,59.3
IBUS  (via drill 0.51)
  Top 0.4: R22.1 70.3,3.04 | 70.3,3.04 R21.1 | 70.3,3.04 67.94,3.04 v67.9,3 R34.1
  Bottom 0.4: J1.3 15.38,6.92 20.3,2 66.9,2 v67.9,3
IBUS_5V  (via drill 0.51)
  Top 0.3: R8.2 46.4,12.6 v47.2,13.4
  Top 0.4: U2.16 C21.2 64,14.6 v62.8,13.4
  Bottom 0.25: v47.2,13.4 v62.8,13.4
IBUS_EN
  Top 0.25: U7.59 51.85,34.25 51.35,33.75 51.35,25.71 52.21,24.85 69.66,24.85 76.3,18.21 76.3,14.1 74.8,12.6 68.8,12.6 67.8,11.6 67.8,6.02 U2.2
IBUS_FILT
  Top 0.4: R22.2 71.9,3.1 | 71.9,3.1 R21.2 | U2.6 72.9,3.1 | C23.1 72.9,3.1 | 71.9,3.1 72.9,3.1
IBUS_PU
  Top 0.4: SW1.1 R34.2
IBUS_URX
  Top 0.25: U7.45 49.25,25.7 51,23.95 69.29,23.95 74.17,19.07 U2.10
IBUS_USTA
  Top 0.25: U7.46 49.75,25.85 51.2,24.4 69.47,24.4 75.44,18.43 U2.9
IBUS_UTX
  Top 0.25: U7.44 48.75,25.55 50.8,23.5 69.1,23.5 72.9,19.7 U2.11
MCU_MCLR
  Top 0.25: U7.7 47.75,41.45 48.4,42.1 R18.2
  Top 0.3: J8.1 38.27,43.37 38.7,43.8 45.3,43.8 45.9,43.2 R18.2
MCU_MCLR_RES
  Top 0.7: R18.1 R17.2 C20.1
MCU_ON_LED  (via drill 0.51)
  Top 0.25: U7.60 58.65,34.75 60.85,36.95 60.85,38.15 61.65,38.95 64.99,38.95 65.34,39.3 74.9,39.3 v75.2,39 | v78.7,38.1 80.4,38.1 84,34.5 84,25.4 85.4,24 R23.2
  Bottom 0.25: v75.2,39 76.6,39 77.5,38.1 v78.7,38.1
MCU_ON_LED_RES
  Top 0.3: R23.1 PWR.+
MCU_PGC
  Top 0.25: U7.15 43.75,37.45 43.3,37 42.84,37 42.16,37.67 36.02,37.67 33.25,40.45 33.25,41.85 33.9,42.5 35.09,42.5 J8.5
MCU_PGD
  Top 0.25: U7.16 43.25,38.05 43.1,37.9 42.57,37.9 42.35,38.12 39.08,38.12 37.95,39.25 37.95,40.91 J8.4
MCU_RECOVERY
  Top 0.25: U7.53 54.15,31.25 56.1,29.3 64.5,29.3 65,29.8 65,32 65.75,32.75 J7.2
MCU_SCK3
  Top 0.25: U7.2 50.25,40.31 51.39,41.45 55.29,41.45 56.4,42.56 56.4,46.8 55.4,47.8 R16.1 51.8,47.8 50.4,46.4 43.4,46.4 42,47.8 31.1,47.8 29.2,49.7 29.2,51.8 28.93,52.08 U10.12
MCU_SDA3
  Top 0.25: U7.3 49.75,40.45 51.2,41.9 55.1,41.9 55.4,42.2 55.4,42.9 55.1,43.2 R15.1 53.2,43.2 52.9,43.5 52.9,45 52.1,45.8 43.3,45.8 41.75,47.35 30.71,47.35 28.06,50 27.1,50 26.7,50.4 26.7,52.6 26.82,52.73 U10.11
MCU_TEL_MUTE
  Top 0.25: U7.31 38.85,29.75 37.75,30.85 26.85,30.85 26,30 25.45,30 R2.1
  Top 0.4: R1.1 R2.1
MCU_TEL_MUTE_RES
  Top 0.4: Q1.1 R1.2
MCU_TEL_ON
  Top 0.25: U7.32 38.71,29.25 37.56,30.4 27.19,30.4 26.49,29.7 26.49,26.51 26.13,26.15 R4.2
  Top 0.4: R4.2 R3.1
MCU_TEL_ON_NRES
  Top 0.4: R3.2 Q2.1
MCU_VCAP
  Top 0.3: U7.56 C18.1 C19.1
MCU_VER
  Top 0.25: R19.1 55.1,37 54.7,37.4 52.07,37.4 51.57,36.9 49.13,36.9 48.25,37.78 U7.6
MIC_BIAS
  Top 0.3: U8.15 70.15,57.05 69.3,57.9 C34.1 R26.2
MICN1
  Top 0.3: U8.13 72.15,56.95 72.6,57.4 73.9,57.4 74.4,57.9 C31.2
MICP1
  Top 0.3: U8.14 71.15,57.85 71,58 C33.2
MICP1_RES
  Top 0.3: R26.1 C35.1 65.3,60.3 64.7,59.7 64.7,59 64.4,58.7 R27.2
RECOVERY_ON
  Top 0.25: J7.1 62.75,35.35 63.1,35.7 R20.1
SPDIF_OUT
  Top 0.3: J5.P$1 9.1,60 10,59.1 13.4,59.1 16,61.7 R30.1 18.3,61.7 R31.2
SPDIF_RST  (via drill 0.51)
  Top 0.25: U7.62 51.79,35.75 50.74,34.7 v43.6,34.7 | v42.1,60.3 44.6,60.3 44.9,60 U9.15
  Bottom 0.25: v43.6,34.7 43,34.7 41.4,36.3 41.4,46 40.1,47.3 40.1,58.3 v42.1,60.3
SPDIF_TX_FLT
  Top 0.3: C52.1 23.7,61.8 24.1,62.2 24.1,64 24.5,64.4 43.2,64.4 46.2,61.4 46.2,57.6 45.88,57.27 U9.18
SPDIF_TX_RES
  Top 0.3: C52.2 R31.1
SPKR_OUT_L  (via drill 0.51)
  Top 0.4: R32.2 C55.1 17.4,56.6 v16.9,56.1
  Bottom 0.4: J2.1 14.27,23.17 15,23.9 15,29.4 15.96,30.36 15.96,51.36 16.9,52.3 v16.9,56.1
SPKR_OUT_R  (via drill 0.51)
  Top 0.4: R33.2 C56.1 18.1,54.6 15,54.6 v14.9,54.5
  Bottom 0.4: J2.4 9.43,23.17 8.8,23.8 8.8,29.4 9.4,30 13.89,30 14.75,30.86 14.75,52.05 14.3,52.5 14.3,53.9 v14.9,54.5
SYS_DTR
  Top 0.25: U3.1 80.14,9.16 78.97,10.33 78.97,16.33 68.95,26.35 56.71,26.35 54.66,28.4 52.2,28.4 51.8,28.8 51.8,30.5 52.05,30.75 U7.52
SYS_RX_LED  (via drill 0.51)
  Top 0.25: U3.17 82.05,11.45 83.2,10.3 v83.5,10.3 | v86.6,20.4 86.6,20.5 87.1,21 R24.2
  Bottom 0.25: v83.5,10.3 85,10.3 86.6,11.9 v86.6,20.4
SYS_RX_LED_RES
  Top 0.3: R24.1 89.5,21.8 89.95,22.25 92.75,22.25 93.15,21.85 RX.-
SYS_TX_LED  (via drill 0.51)
  Top 0.25: U3.10 85.86,7.24 86.5,6.6 v87.7,6.6 | R25.2 87.9,16.8 v88.2,16.5
  Bottom 0.25: v87.7,6.6 88.3,6.6 88.6,6.9 88.6,16.1 v88.2,16.5
SYS_TX_LED_RES
  Top 0.3: R25.1 89.5,17.2 89.96,16.74 92.74,16.74 93.15,17.15 TX.-
SYS_URX
  Top 0.25: U3.4 82.05,10.25 81.5,10.8 80.4,10.8 79.42,11.78 79.42,16.51 69.14,26.8 56.9,26.8 54.45,29.25 U7.49
SYS_USB_DN
  Top 0.3: U3.12 85.22,12.38 88.25,9.35 J6.2
SYS_USB_DP
  Top 0.3: U3.11 85.86,12.45 88.31,10 J6.3
SYS_UTX
  Top 0.25: U3.20 80.14,16.43 69.32,27.25 57.11,27.25 54.61,29.75 U7.50
TEL_AMP_IN
  Top 0.3: C49.1 FB3.2
TEL_AMP_INL
  Top 0.3: U11.7 27.17,37.13 R29.2
TEL_AMP_INL_CAP_RES
  Top 0.25: R29.1 27.2,34.4 27.7,33.9 30.1,33.9 31,34.8 C49.2
TEL_AMP_OUT_L+
  Top 0.4: FB2.1 19.1,41 19.6,40.5 19.6,39.25 U11.1
TEL_AMP_OUT_L-
  Top 0.4: FB1.1 19.7,43 22.1,40.6 U11.3
TEL_AMP_SHDN
  Top 0.25: U11.12 24.63,43.47 26.1,42 32.1,42 32.6,41.5 32.6,40.46 35.84,37.23 41.98,37.23 43.4,35.8 51.2,35.8 51.65,36.25 U7.63
TEL_AMP_VREF
  Top 0.4: U11.8 28.44,38.06 28.7,37.8 C48.1
TEL_MIC_L_OUT
  Top 0.3: J3.3 1.3,40.1 0.6,40.8 0.6,44.3 1.4,45.1 7.1,45.1 7.6,45.6 8.4,45.6 8.5,45.5
  Top 0.4: R28.2 8.5,45.5 C40.2
TEL_MUTE_IO
  Top 0.3: J3.6 4.52,36.28 5.2,35.6 14.7,35.6 16.2,34.1 16.2,30.71 17.51,29.4 Q1.3
TEL_ON
  Top 0.4: R7.1 23.95,19.6 Q3.3
TEL_ON_IO
  Top 0.3: J3.5 1.98,36.22 3.1,35.1 14.49,35.1 15.7,33.89 15.7,30.5 18.4,27.8 18.4,20.1 18.9,19.6 R7.2
TEL_ON_P
  Top 0.4: Q2.3 19.7,25.3 R5.1 R6.1
TEL_ON_P_RES
  Top 0.3: R6.2 21.9,21.3 22.5,20.7 24.7,20.7 24.95,20.95 Q3.1
TEL_OUT_L+
  Top 0.4: J3.1 1.98,43.48 2.8,44.3 5.1,44.3 8.3,41.1 13.5,41.1 14.4,40.2 15.4,40.2 | FB2.2 15.4,40.2 | 15.4,40.2 C44.1
TEL_OUT_L-  (via drill 0.51)
  Top 0.4: J3.2 5.91,42.64 8.05,40.5 11.3,40.5 v11.8,40 | v13.1,42.3 14.6,43.8 15.4,43.8 | C43.1 15.4,43.8 | 15.4,43.8 FB1.2
  Bottom 0.4: v11.8,40 12.8,40 13.1,40.3 v13.1,42.3
USB_3V3  (via drill 0.51)
  Top 0.3: U3.3 81.41,9.29 v81,9.7 | U3.13 84.59,12.43 v84.36,12.2
  Top 0.35: C26.1 84.8,15.4 84.8,14.8 84.59,14.59 U3.13 U3.14
  Top 0.4: 84.8,15.4 85.7,15.4 86.2,15.9 86.2,18.3 87.4,19.5 90.8,19.5 | RX.+ 91.35,20.05 90.8,19.5 | 90.8,19.5 90.9,19.5 90.9,19.4 91.35,18.95 TX.+
  Bottom 0.3: v81,9.7 81,11.4 81.5,11.9 84.06,11.9 v84.36,12.2
USB_5V
  Top 0.4: J6.1 89.9,8.7 89.6,8.4 D3.A
VBAT
  Top 1: J1.2 D1.A
VBAT_DIODE
  Top 1: D1.C 8.55,13.75 8.9,14.1 9.5,14.7 D2.C
  Top 1.5: F1.IN 12.35,14.1 D2.C
VBAT_FLT
  Top 1.5: L1.1 19.45,10.5 F1.OUT
VIN  (via drill 0.51)
  Top 0.4: v37.8,15 35.3,17.5 35.3,18.2 34.95,18.55 C3.1 U4.1 | U1.2 C11.1 | SW1.2 56.9,5.8 57.2,6.1
  Top 0.5: v37.8,8 37.8,5.6
  Top 0.6: C22.1 U2.1
  Top 0.7: C9.1 C10.1 C11.1 | 58.6,6.1 58.75,5.95 64.25,5.95 C22.1
  Top 1: L1.4 31.5,10.5 32.6,9.4 32.6,7.6 34.6,5.6 C4.1 37.8,5.6 41.5,1.9 54,1.9 55.1,3 55.1,4.8 56.4,6.1 57.2,6.1 58.6,6.1 59.7,7.2 C9.1
  Bottom 0.5: v37.8,8 v37.8,15

### Text on the board
bNames: S/PDIF | MIC IN | TEL_OUT+ | TEL_OUT- | MIC+ | MIC- | TEL_ON | TEL_MUTE | NC | NC | AGND | AGND | OUT_R | OUT_L | GND | VIN | I/K-BUS
_tNames: R31 | C52 | C50 | C61 | R30 | C51 | C62 | C35 | R26 | C33 | C32 | C31 | J5 | R27 | R32 | C53 | C54 | C34 | C55 | C60 | C59 | C36 | C37 | C56 | R33 | C57 | C58 | C38 | C39 | FB4 | C27 | J4 | C28 | U10 | U9 | C29 | C41 | U8 | C30 | C42 | R16 | C40 | R18 | R17 | C20 | C43 | FB3 | PGC | GND | MCLR | R15 | R28 | FB1 | U11 | C14 | FB2 | NC | PGD | 3.3v | J3 | C44 | C49 | R20 | C45 | R19 | C46 | C15 | BlueBus | C47 | R29 | C48 | HW VER. 2.2 | U7 | C18 | C19 | C16 | Designed in U.S.A. | R1 | R2 | Assembled in / Australia & U.S.A. | Q1 | C1 | APP | BOOT | J2 | Q2 | U6 | RECOVERY | C17 | R23 | PWR | R3 | R4 | R5 | R14 | U4 | R24 | RX | R6 | R7 | C12 | C13 | Q3 | R25 | TX | C2 | C3 | C5 | U5 | C6 | D2 | C21 | C24 | L2 | C25 | C26 | C4 | USB | R8 | R9 | C10 | C9 | L1 | C7 | C11 | U2 | U3 | J1 | D1 | F1 | U1 | R10 | R11 | R12 | C22 | D3 | R22 | C8 | R13 | R34 | R21 | C23 | I/K-BUS PULL UP